# Altium project Invertor 2000W.PrjPcb
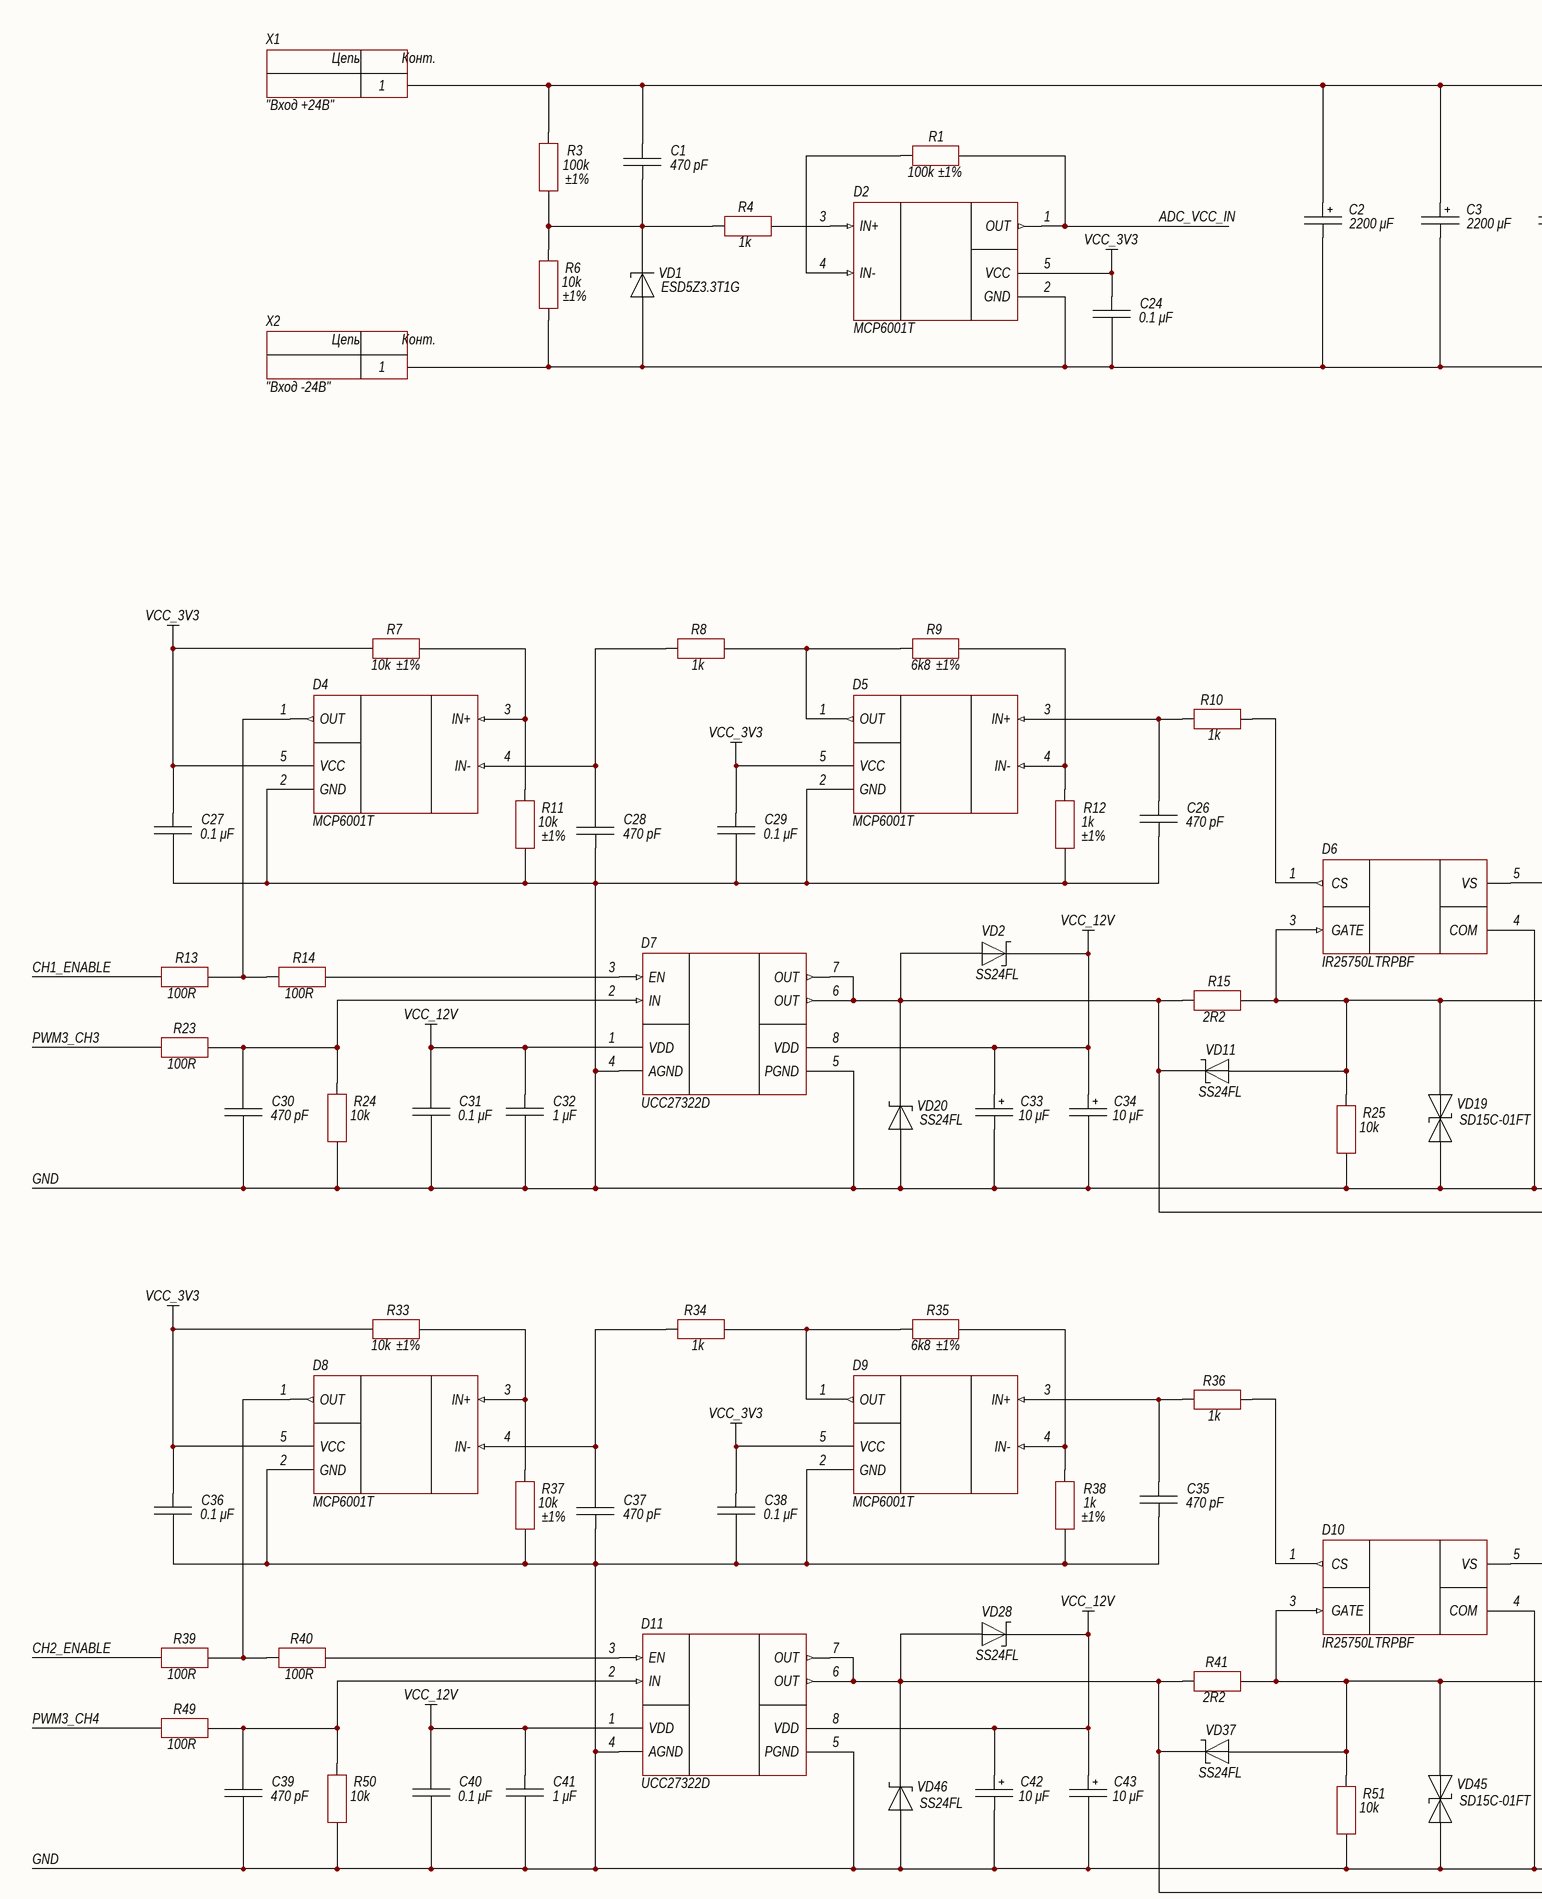
[diagram p0: Page 1.SchDoc, top left]
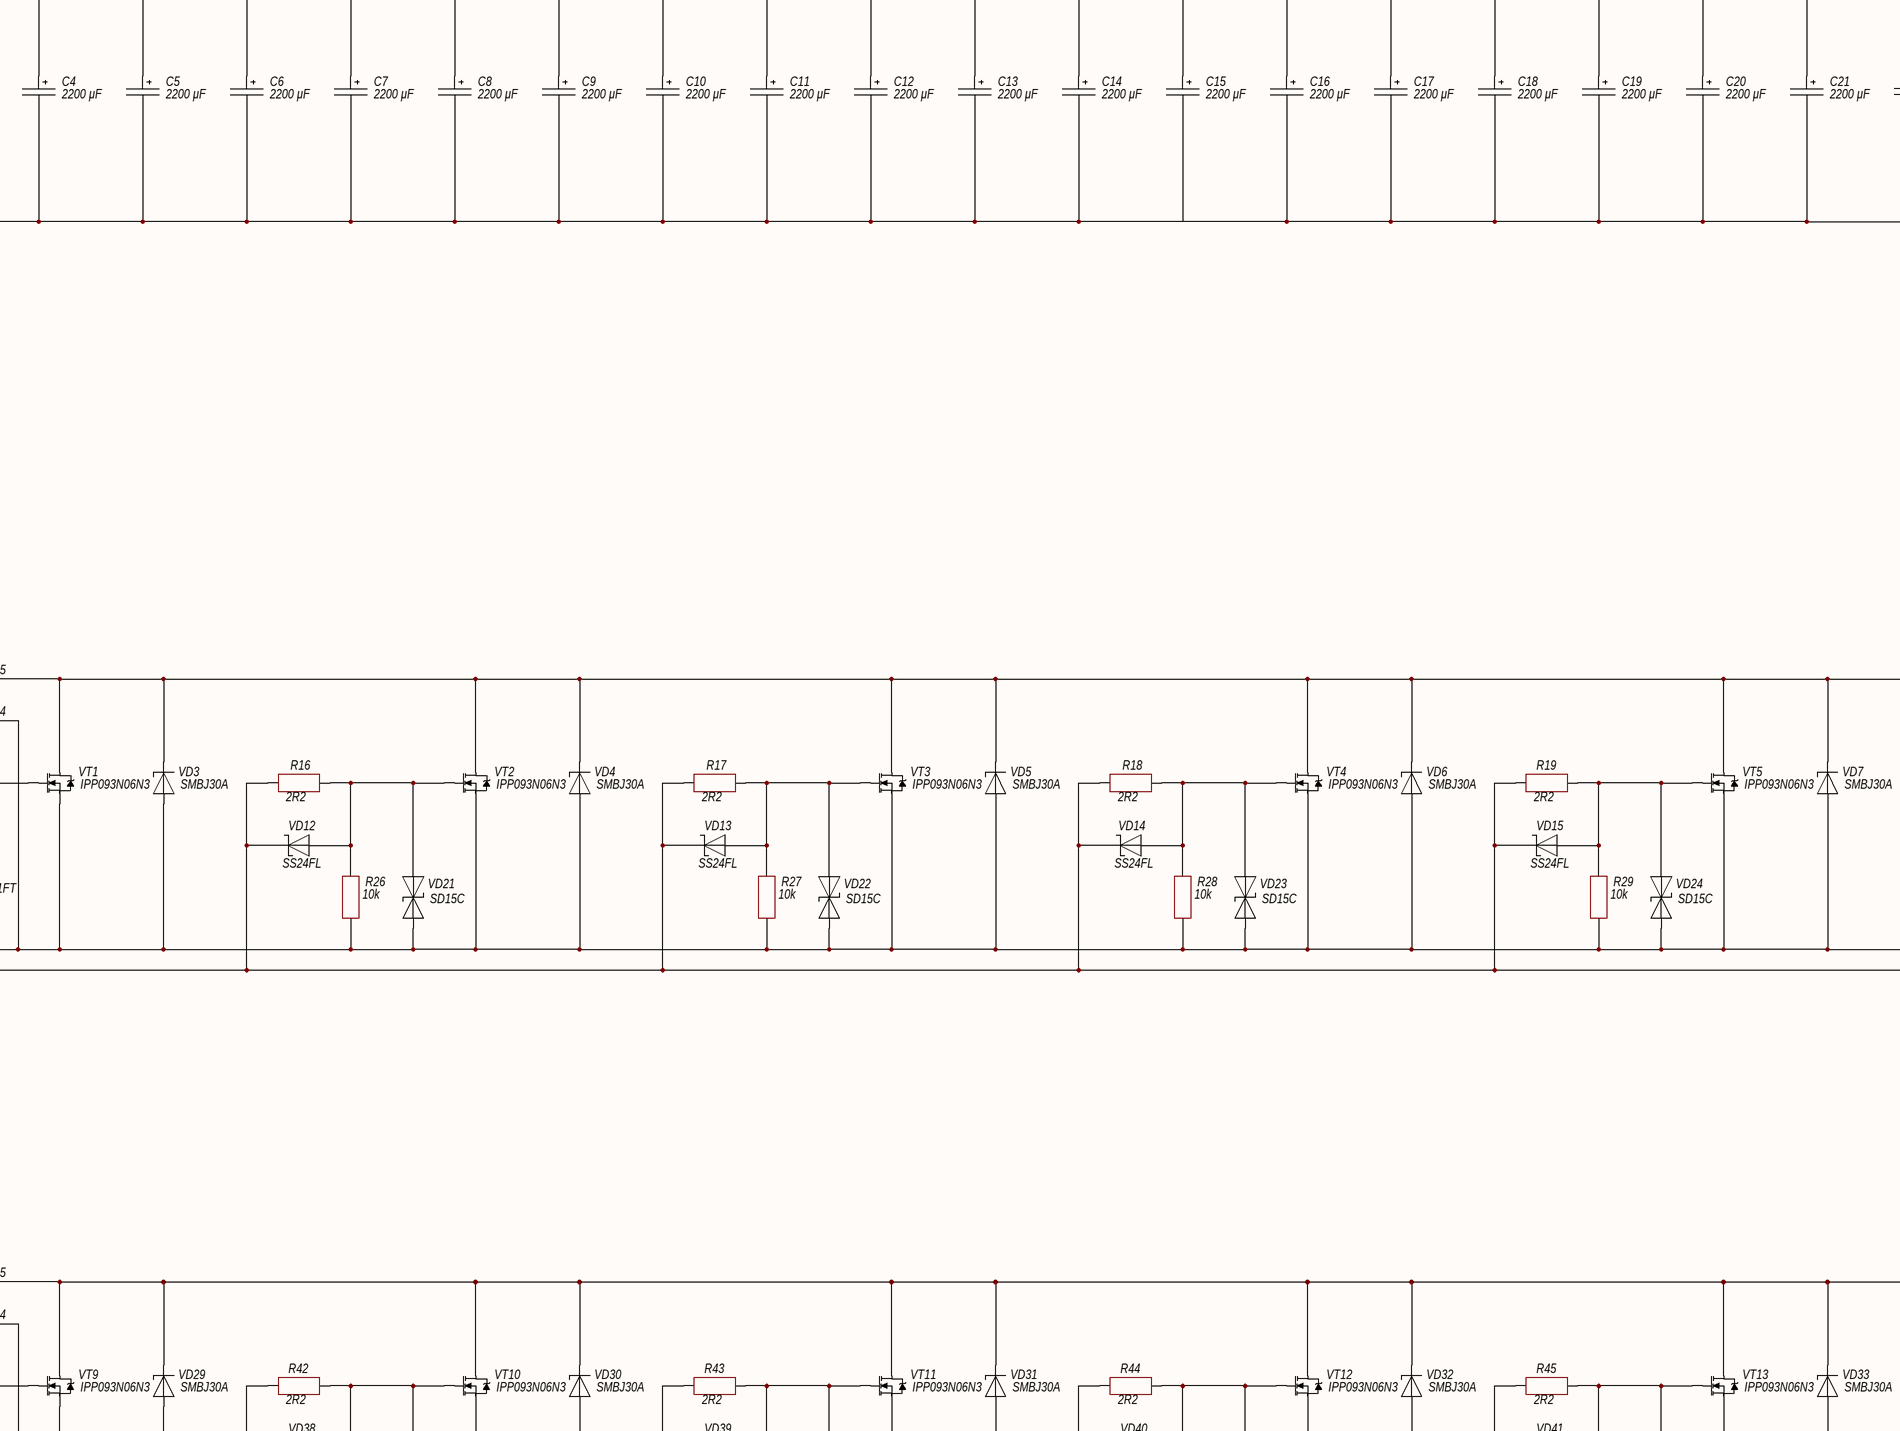
[diagram p1: Page 1.SchDoc, top middle]
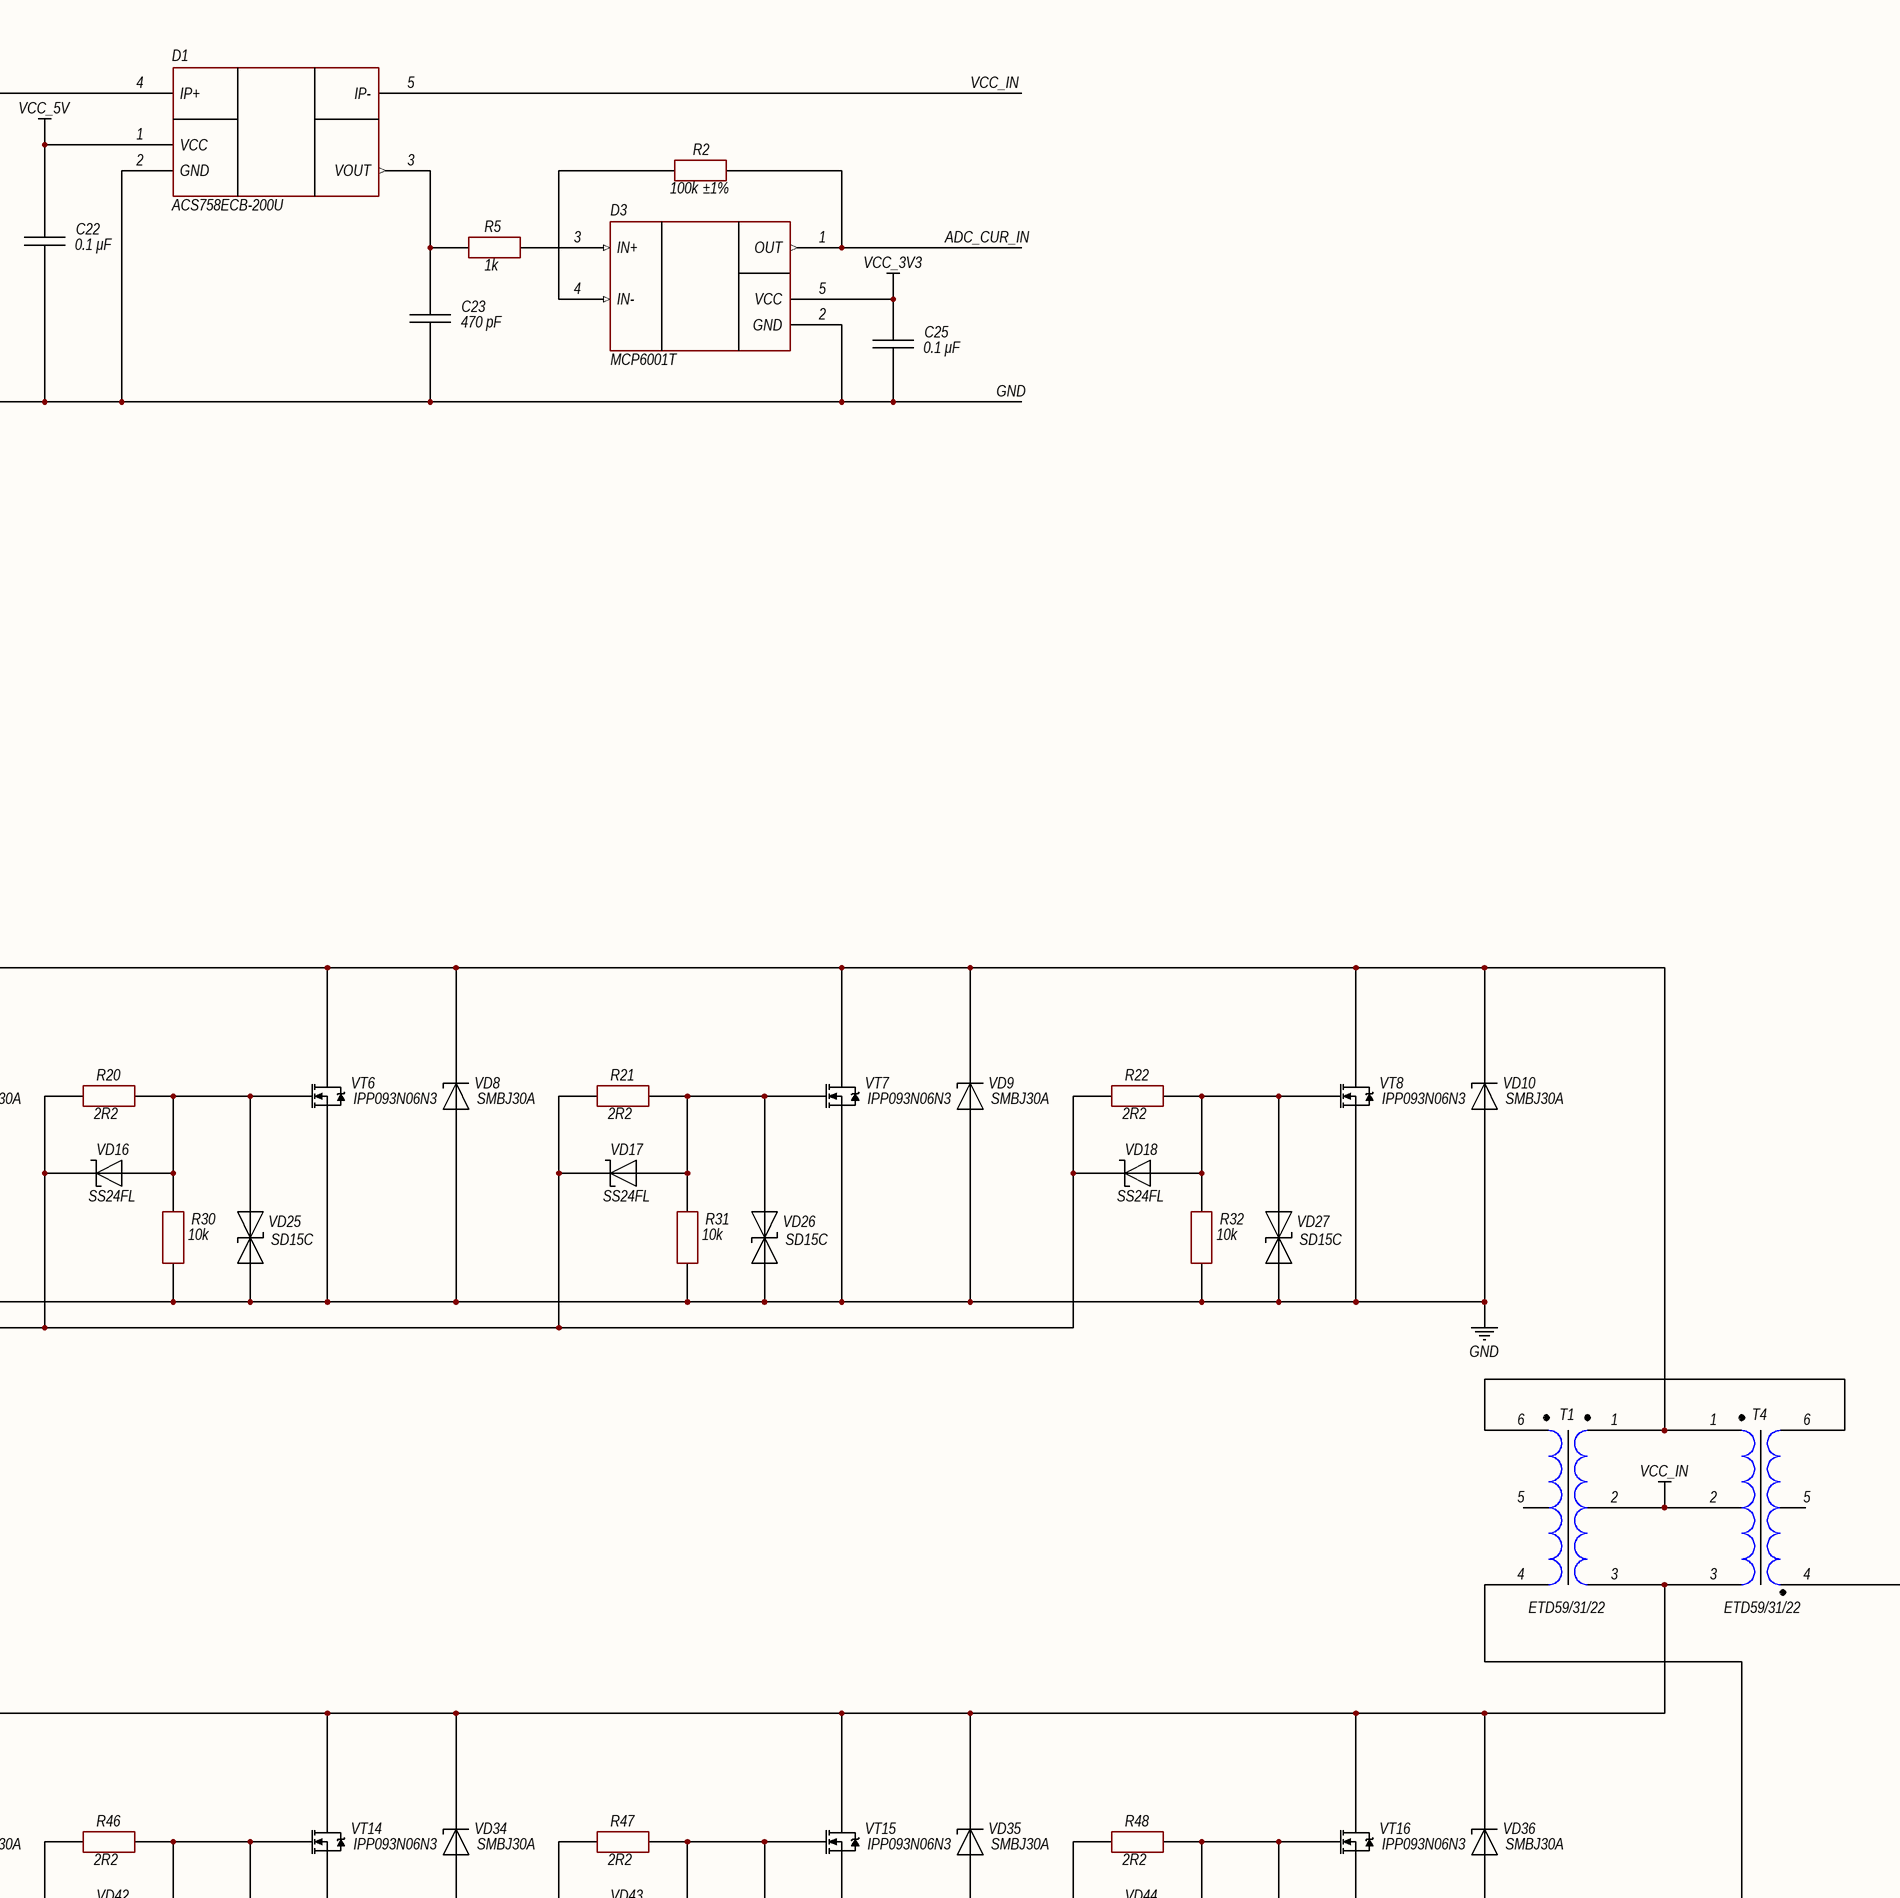
[diagram p2: Page 1.SchDoc, top right]
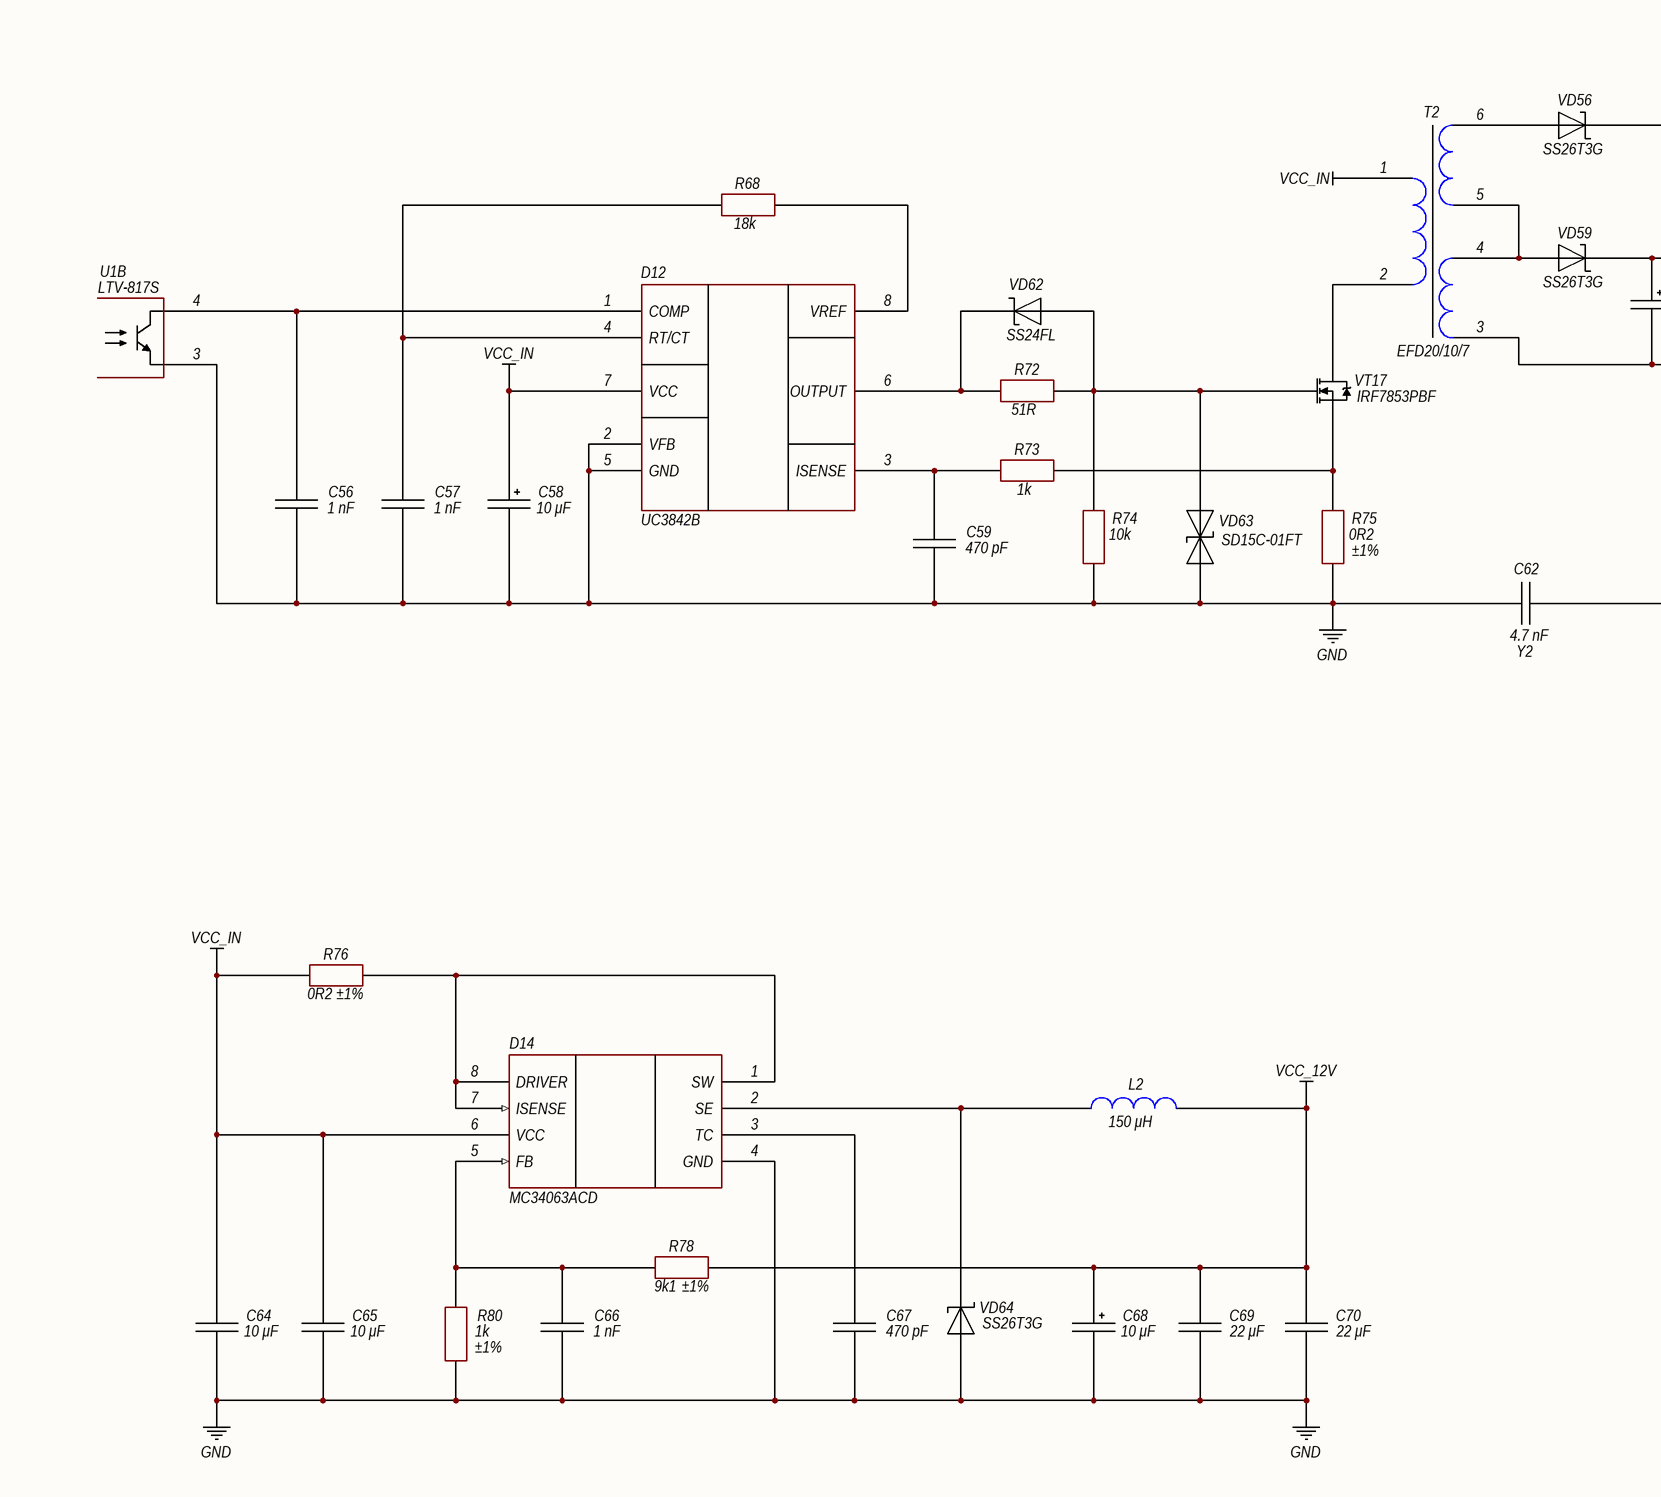
[diagram p3: Page 1.SchDoc, bottom left]
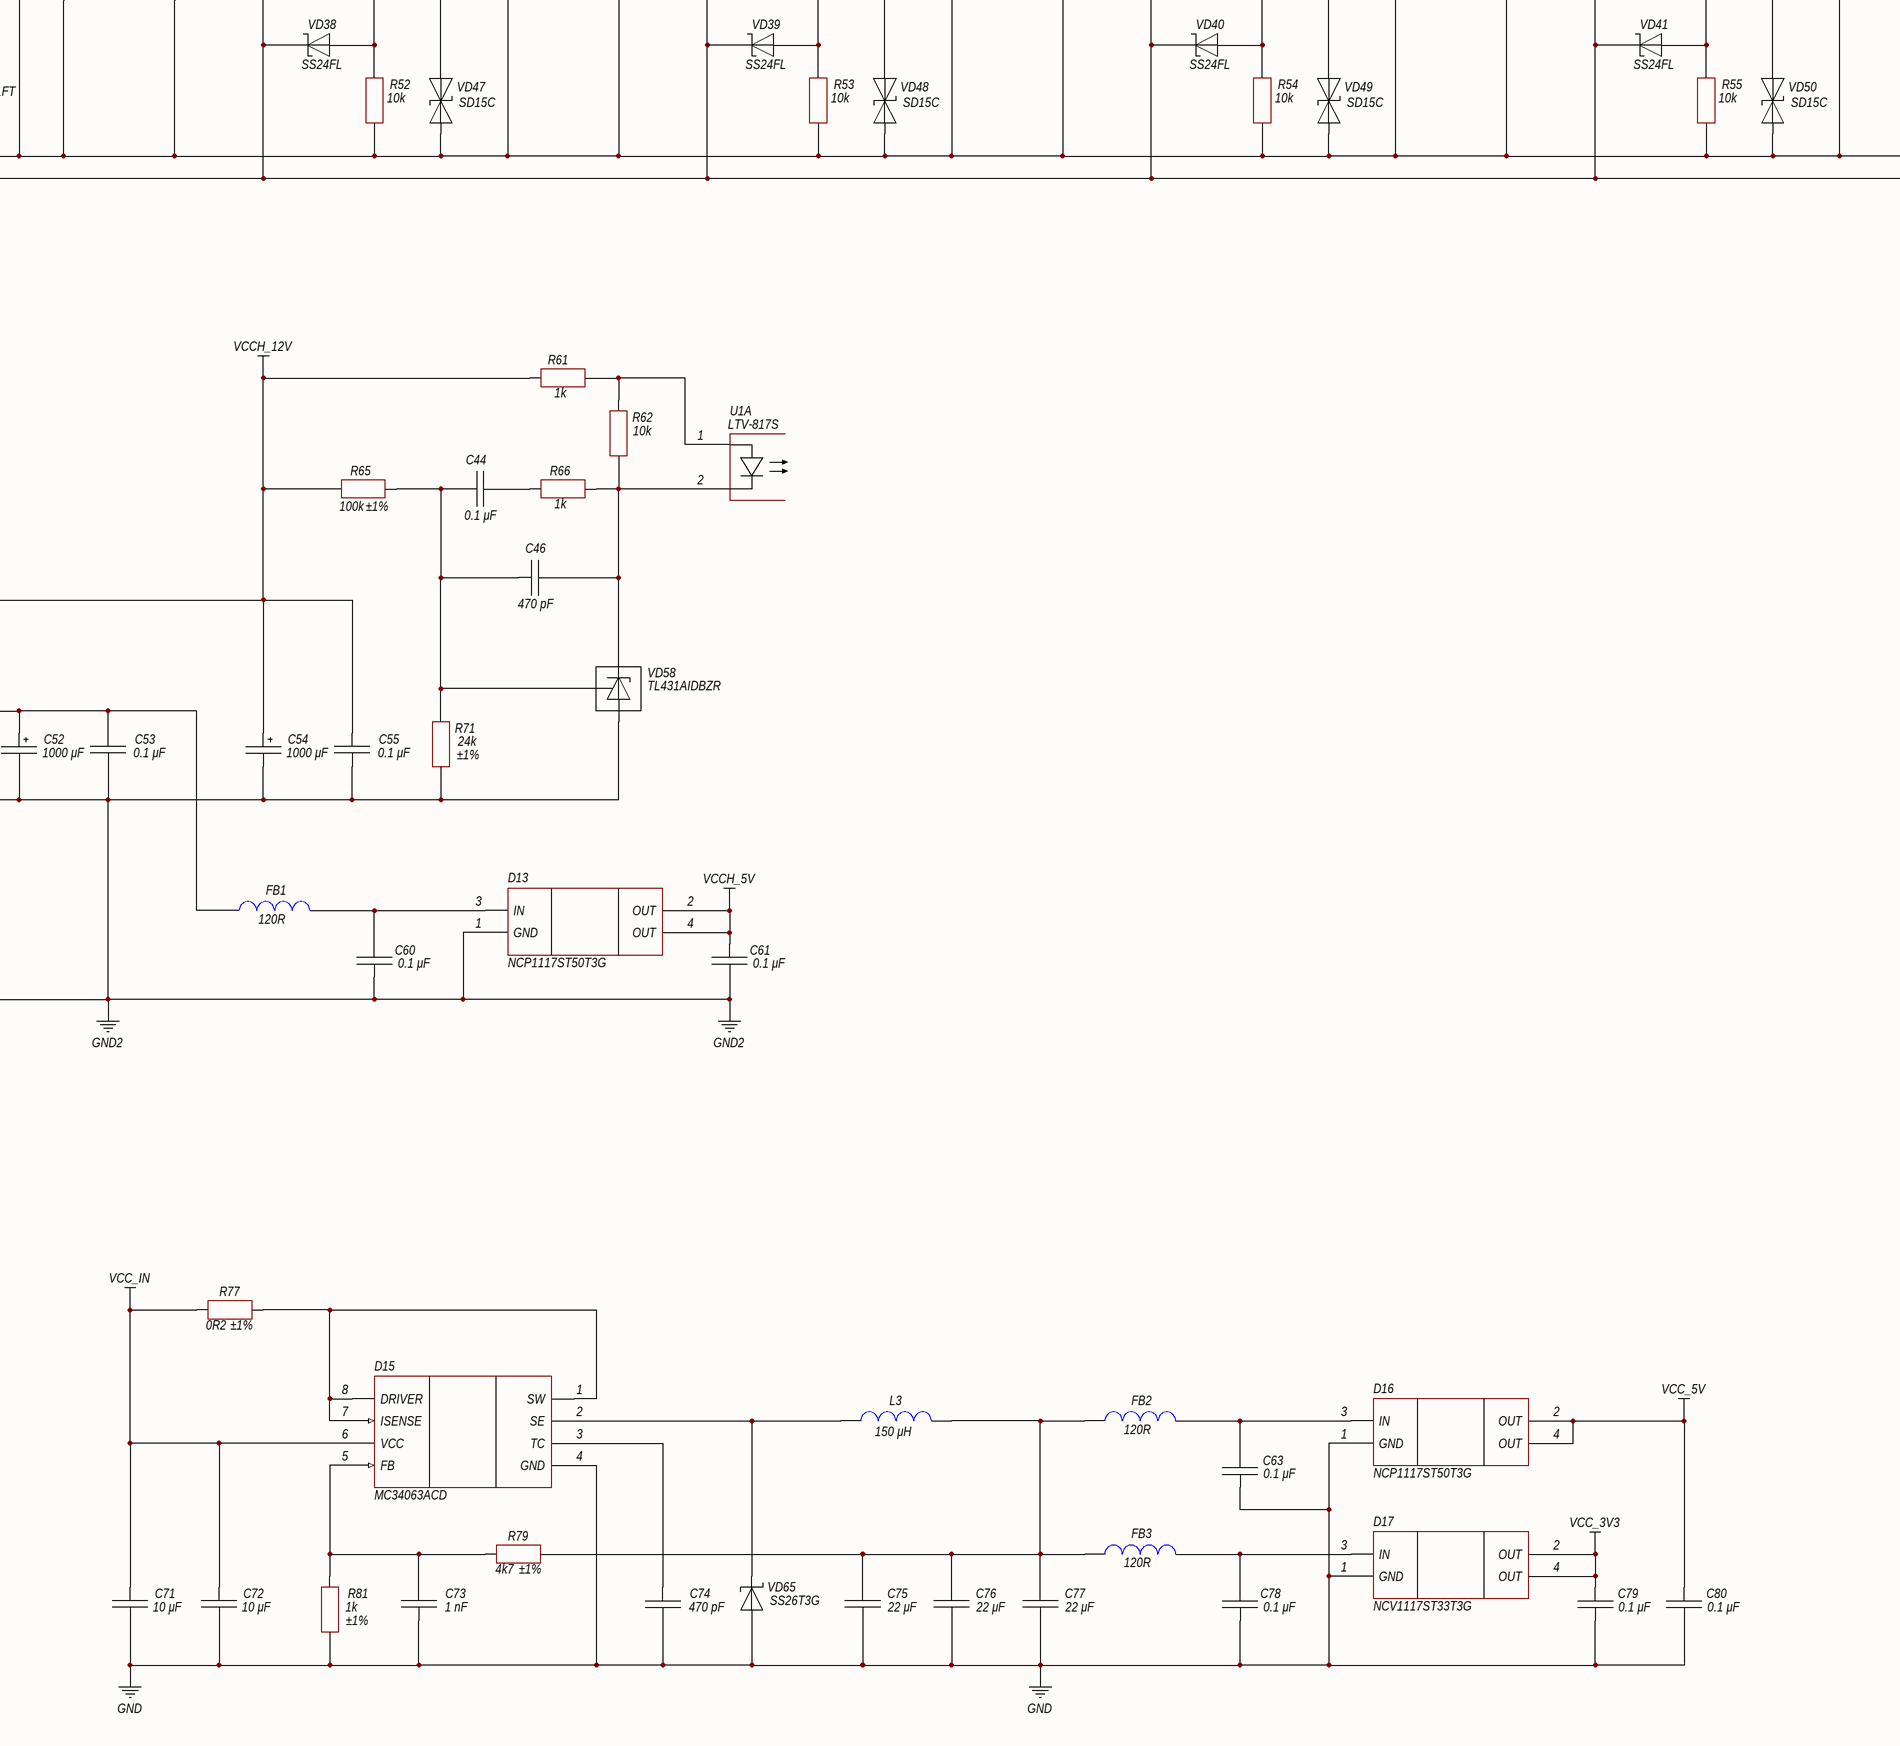
[diagram p4: Page 1.SchDoc, bottom middle]
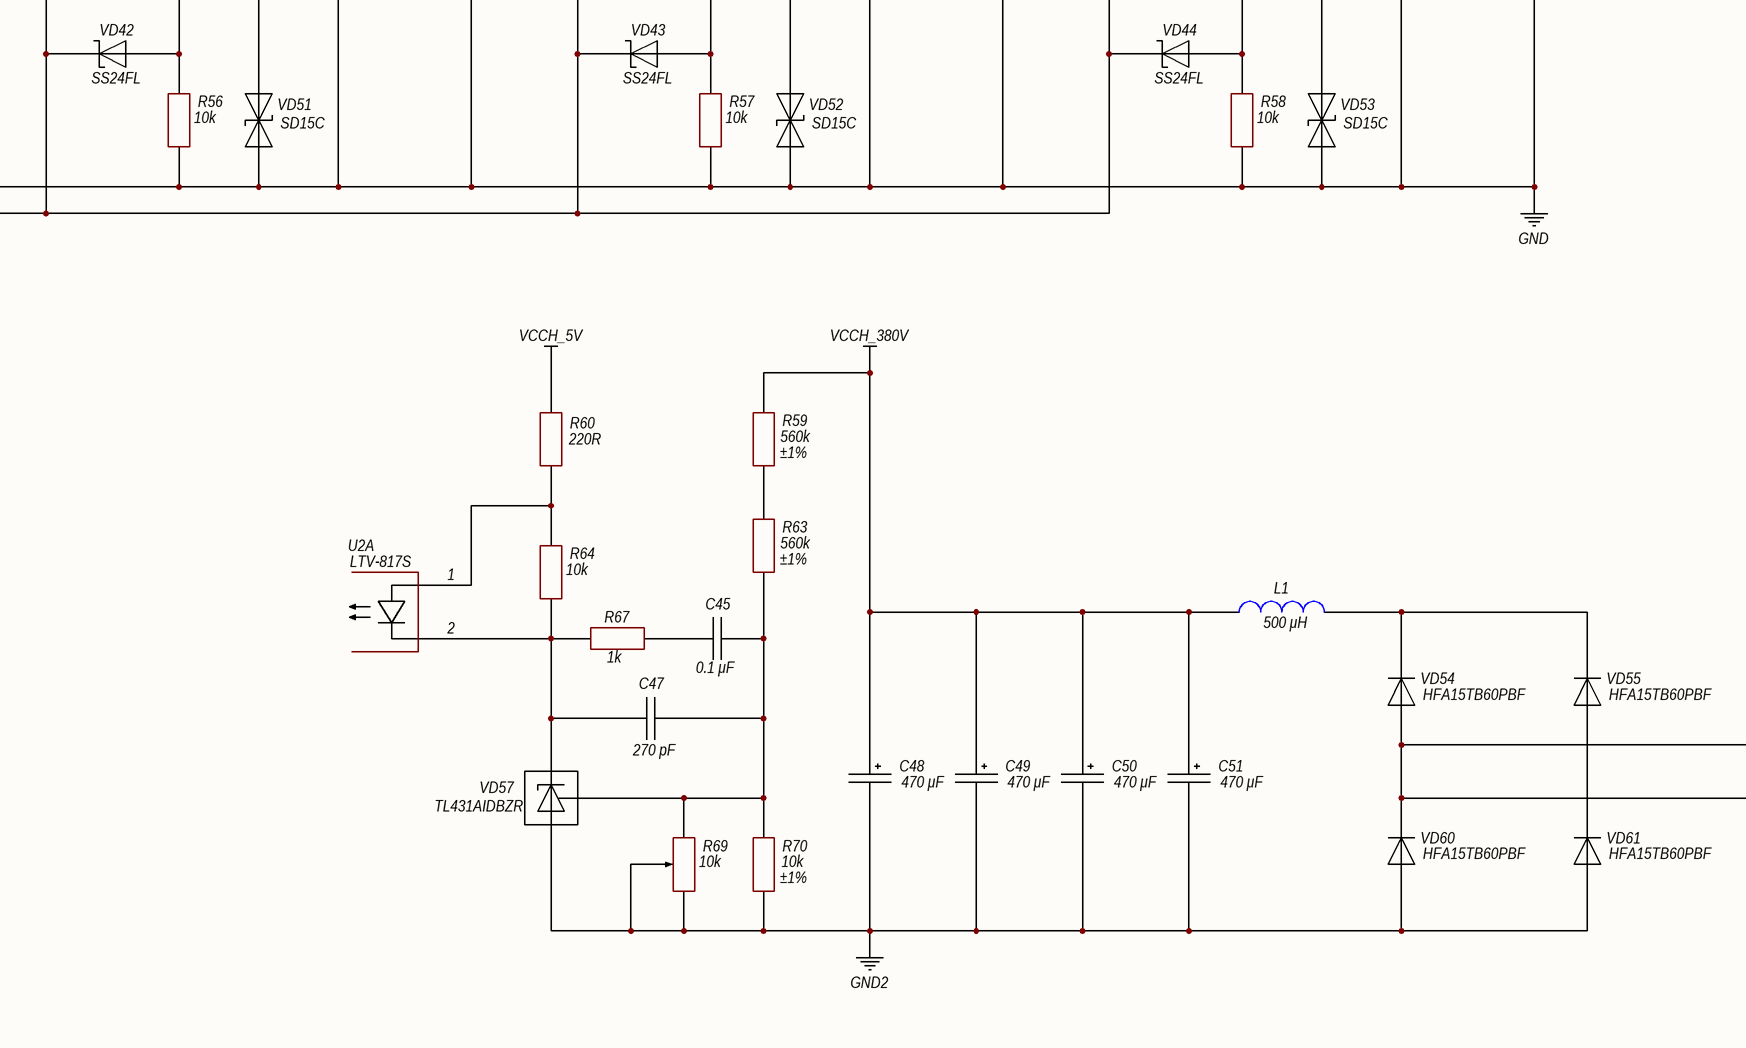
[diagram p5: Page 1.SchDoc, bottom right]
3 sheets, 447 parts. Net scope: global (net labels, ports and power ports of the same name join across sheets).
Board file: PCB for invertor.PcbDoc
Sheets:
  Page 1.SchDoc
  Page 2.SchDoc
  Page 3.SchDoc

## Sheet Page 1.SchDoc: Инвертор напряжения 24-380-230В
size 1188 x 840 mm; CompanyName: Nordic Energy; Address1: Address1; Address2: Address2; Address3: Address3; Address4: Address4; DocumentNumber: НЭС.185014.2017-5.1; SheetNumber: 1; SheetTotal: 3; Scale: 1:1; Title2str: номинальной мощностью 2000 Вт; DocumentType: Схема электрическая принципиальная; FirstReferrence: НЭС.185014.2017-5.1

### Parts
C1  470 pF  [CH0805C]
C2  2200 μF  [D16C7.5H25]
C3  2200 μF  [D16C7.5H25]
C4  2200 μF  [D16C7.5H25]
C5  2200 μF  [D16C7.5H25]
C6  2200 μF  [D16C7.5H25]
C7  2200 μF  [D16C7.5H25]
C8  2200 μF  [D16C7.5H25]
C9  2200 μF  [D16C7.5H25]
C10  2200 μF  [D16C7.5H25]
C11  2200 μF  [D16C7.5H25]
C12  2200 μF  [D16C7.5H25]
C13  2200 μF  [D16C7.5H25]
C14  2200 μF  [D16C7.5H25]
C15  2200 μF  [D16C7.5H25]
C16  2200 μF  [D16C7.5H25]
C17  2200 μF  [D16C7.5H25]
C18  2200 μF  [D16C7.5H25]
C19  2200 μF  [D16C7.5H25]
C20  2200 μF  [D16C7.5H25]
C21  2200 μF  [D16C7.5H25]
C22  0.1 μF  [CH0805C]
C23  470 pF  [CH0805C]
C24  0.1 μF  [CH0805C]
C25  0.1 μF  [CH0805C]
C26  470 pF  [CH0805C]
C27  0.1 μF  [CH0805C]
C28  470 pF  [CH0805C]
C29  0.1 μF  [CH0805C]
C30  470 pF  [CH0805C]
C31  0.1 μF  [CH0805C]
C32  1 μF  [CH0805C]
C33  10 μF  [TANTAL_C]
C34  10 μF  [TANTAL_C]
C35  470 pF  [CH0805C]
C36  0.1 μF  [CH0805C]
C37  470 pF  [CH0805C]
C38  0.1 μF  [CH0805C]
C39  470 pF  [CH0805C]
C40  0.1 μF  [CH0805C]
C41  1 μF  [CH0805C]
C42  10 μF  [TANTAL_C]
C43  10 μF  [TANTAL_C]
C44  0.1 μF  [CH0805C]
C45  0.1 μF  [CH0805C]
C46  470 pF  [CH0805C]
C47  270 pF  [CH0805C]
C48  470 μF  [D35C10.5H50]
C49  470 μF  [D35C10.5H50]
C50  470 μF  [D35C10.5H50]
C51  470 μF  [D35C10.5H50]
C52  1000 μF  [D10C5H20]
C53  0.1 μF  [CH0805C]
C54  1000 μF  [D10C5H20]
C55  0.1 μF  [CH0805C]
C56  1 nF  [CH0805C]
C57  1 nF  [CH0805C]
C58  10 μF  [TANTAL_C]
C59  470 pF  [CH0805C]
C60  0.1 μF  [CH0805C]
C61  0.1 μF  [CH0805C]
C62  4.7 nF  ComponentKind: Y2  [CAP: B32021]
C63  0.1 μF  [CH0805C]
C64  10 μF  [CH1206C]
C65  10 μF  [CH1206C]
C66  1 nF  [CH0805C]
C67  470 pF  [CH0805C]
C68  10 μF  [TANTAL_C]
C69  22 μF  [CH1206C]
C70  22 μF  [CH1206C]
C71  10 μF  [CH1206C]
C72  10 μF  [CH1206C]
C73  1 nF  [CH0805C]
C74  470 pF  [CH0805C]
C75  22 μF  [CH1206C]
C76  22 μF  [CH1206C]
C77  22 μF  [CH1206C]
C78  0.1 μF  [CH0805C]
C79  0.1 μF  [CH0805C]
C80  0.1 μF  [CH0805C]
D1  ACS758ECB-200U  [IC: ACS770]
D2  MCP6001T  [SOT23-5]
D3  MCP6001T  [SOT23-5]
D4  MCP6001T  [SOT23-5]
D5  MCP6001T  [SOT23-5]
D6  IR25750LTRPBF  [SOT23-5]
D7  UCC27322D  [8-SOIC]
D8  MCP6001T  [SOT23-5]
D9  MCP6001T  [SOT23-5]
D10  IR25750LTRPBF  [SOT23-5]
D11  UCC27322D  [8-SOIC]
D12  UC3842B  [8-SOIC]
D13  NCP1117ST50T3G  [SOT223]
D14  MC34063ACD  [8-SOIC]
D15  MC34063ACD  [8-SOIC]
D16  NCP1117ST50T3G  [SOT223]
D17  NCV1117ST33T3G  [SOT223]
FB1  120R  [CH0805L]
FB2  120R  [CH0805L]
FB3  120R  [CH0805L]
L1  500 μH  [IND: R46]
L2  150 μH  [IND: B82477G4]
L3  150 μH  [IND: B82477G4]
R1  100k  ComponentKind: ±1%  [CH0805R]
R2  100k  ComponentKind: ±1%  [CH0805R]
R3  100k  ComponentKind: ±1%  [CH0805R]
R4  1k  [CH0805R]
R5  1k  [CH0805R]
R6  10k  ComponentKind: ±1%  [CH0805R]
R7  10k  ComponentKind: ±1%  [CH0805R]
R8  1k  [CH0805R]
R9  6k8  ComponentKind: ±1%  [CH0805R]
R10  1k  [CH0805R]
R11  10k  ComponentKind: ±1%  [CH0805R]
R12  1k  ComponentKind: ±1%  [CH0805R]
R13  100R  [CH0805R]
R14  100R  [CH0805R]
R15  2R2  [CH0805R]
R16  2R2  [CH0805R]
R17  2R2  [CH0805R]
R18  2R2  [CH0805R]
R19  2R2  [CH0805R]
R20  2R2  [CH0805R]
R21  2R2  [CH0805R]
R22  2R2  [CH0805R]
R23  100R  [CH0805R]
R24  10k  [CH0805R]
R25  10k  [CH0805R]
R26  10k  [CH0805R]
R27  10k  [CH0805R]
R28  10k  [CH0805R]
R29  10k  [CH0805R]
R30  10k  [CH0805R]
R31  10k  [CH0805R]
R32  10k  [CH0805R]
R33  10k  ComponentKind: ±1%  [CH0805R]
R34  1k  [CH0805R]
R35  6k8  ComponentKind: ±1%  [CH0805R]
R36  1k  [CH0805R]
R37  10k  ComponentKind: ±1%  [CH0805R]
R38  1k  ComponentKind: ±1%  [CH0805R]
R39  100R  [CH0805R]
R40  100R  [CH0805R]
R41  2R2  [CH0805R]
R42  2R2  [CH0805R]
R43  2R2  [CH0805R]
R44  2R2  [CH0805R]
R45  2R2  [CH0805R]
R46  2R2  [CH0805R]
R47  2R2  [CH0805R]
R48  2R2  [CH0805R]
R49  100R  [CH0805R]
R50  10k  [CH0805R]
R51  10k  [CH0805R]
R52  10k  [CH0805R]
R53  10k  [CH0805R]
R54  10k  [CH0805R]
R55  10k  [CH0805R]
R56  10k  [CH0805R]
R57  10k  [CH0805R]
R58  10k  [CH0805R]
R59  560k  ComponentKind: ±1%  [CH0805R]
R60  220R  [CH0805R]
R61  1k  [CH0805R]
R62  10k  [CH0805R]
R63  560k  ComponentKind: ±1%  [CH0805R]
R64  10k  [CH0805R]
R65  100k  ComponentKind: ±1%  [CH0805R]
R66  1k  [CH0805R]
R67  1k  [CH0805R]
R68  18k  [CH0805R]
R69  10k  [RES: 3296W]
R70  10k  ComponentKind: ±1%  [CH0805R]
R71  24k  ComponentKind: ±1%  [CH0805R]
R72  51R  [CH0805R]
R73  1k  [CH0805R]
R74  10k  [CH0805R]
R75  0R2  ComponentKind: ±1%  [CH1206R]
R76  0R2  ComponentKind: ±1%  [CH1206R]
R77  0R2  ComponentKind: ±1%  [CH1206R]
R78  9k1  ComponentKind: ±1%  [CH0805R]
R79  4k7  ComponentKind: ±1%  [CH0805R]
R80  1k  ComponentKind: ±1%  [CH0805R]
R81  1k  ComponentKind: ±1%  [CH0805R]
T1  ETD59/31/22  [TRANS: ETD59/31/22]
T2  EFD20/10/7  [TRANS: EFD20/10/7]
T4  ETD59/31/22  [TRANS: ETD59/31/22]
U1  LTV-817S  [4-SMD]  (parts A,B of 2)
U2  LTV-817S  [4-SMD]  (part A of 2)
VD1  ESD5Z3.3T1G  [SOD523]
VD2  SS24FL  [SOD123F]
VD3  SMBJ30A  [SMB]
VD4  SMBJ30A  [SMB]
VD5  SMBJ30A  [SMB]
VD6  SMBJ30A  [SMB]
VD7  SMBJ30A  [SMB]
VD8  SMBJ30A  [SMB]
VD9  SMBJ30A  [SMB]
VD10  SMBJ30A  [SMB]
VD11  SS24FL  [SOD123F]
VD12  SS24FL  [SOD123F]
VD13  SS24FL  [SOD123F]
VD14  SS24FL  [SOD123F]
VD15  SS24FL  [SOD123F]
VD16  SS24FL  [SOD123F]
VD17  SS24FL  [SOD123F]
VD18  SS24FL  [SOD123F]
VD19  SD15C-01FT  [SOD323]
VD20  SS24FL  [SOD123F]
VD21  SD15C  [SOD323]
VD22  SD15C  [SOD323]
VD23  SD15C  [SOD323]
VD24  SD15C  [SOD323]
VD25  SD15C  [SOD323]
VD26  SD15C  [SOD323]
VD27  SD15C  [SOD323]
VD28  SS24FL  [SOD123F]
VD29  SMBJ30A  [SMB]
VD30  SMBJ30A  [SMB]
VD31  SMBJ30A  [SMB]
VD32  SMBJ30A  [SMB]
VD33  SMBJ30A  [SMB]
VD34  SMBJ30A  [SMB]
VD35  SMBJ30A  [SMB]
VD36  SMBJ30A  [SMB]
VD37  SS24FL  [SOD123F]
VD38  SS24FL  [SOD123F]
VD39  SS24FL  [SOD123F]
VD40  SS24FL  [SOD123F]
VD41  SS24FL  [SOD123F]
VD42  SS24FL  [SOD123F]
VD43  SS24FL  [SOD123F]
VD44  SS24FL  [SOD123F]
VD45  SD15C-01FT  [SOD323]
VD46  SS24FL  [SOD123F]
VD47  SD15C  [SOD323]
VD48  SD15C  [SOD323]
VD49  SD15C  [SOD323]
VD50  SD15C  [SOD323]
VD51  SD15C  [SOD323]
VD52  SD15C  [SOD323]
VD53  SD15C  [SOD323]
VD54  HFA15TB60PBF  [TO220-2]
VD55  HFA15TB60PBF  [TO220-2]
VD56  SS26T3G  [SMB]
VD57  TL431AIDBZR  [SOT23_132]
VD58  TL431AIDBZR  [SOT23_132]
VD59  SS26T3G  [SMB]
VD60  HFA15TB60PBF  [TO220-2]
VD61  HFA15TB60PBF  [TO220-2]
VD62  SS24FL  [SOD123F]
VD63  SD15C-01FT  [SOD323]
VD64  SS26T3G  [SMB]
VD65  SS26T3G  [SMB]
VT1  IPP093N06N3  [TO220_123]
VT2  IPP093N06N3  [TO220_123]
VT3  IPP093N06N3  [TO220_123]
VT4  IPP093N06N3  [TO220_123]
VT5  IPP093N06N3  [TO220_123]
VT6  IPP093N06N3  [TO220_123]
VT7  IPP093N06N3  [TO220_123]
VT8  IPP093N06N3  [TO220_123]
VT9  IPP093N06N3  [TO220_123]
VT10  IPP093N06N3  [TO220_123]
VT11  IPP093N06N3  [TO220_123]
VT12  IPP093N06N3  [TO220_123]
VT13  IPP093N06N3  [TO220_123]
VT14  IPP093N06N3  [TO220_123]
VT15  IPP093N06N3  [TO220_123]
VT16  IPP093N06N3  [TO220_123]
VT17  IRF7853PBF  [TRANS: SO-8]
X1  "Вход +24В"  [CON: 7461383]
X2  "Вход -24В"  [CON: 7461383]

### Nets
GND: C2.2 C3.2 C4.2 C5.2 C6.2 C7.2 C8.2 C9.2 C10.2 C11.2 C12.2 C13.2 C14.2 C15.2 C16.2 C17.2 C18.2 C19.2 C20.2 C21.2 C22.1 C23.2 C24.1 C25.1 C26.2 C27.1 C28.2 C29.1 C30.2 C31.1 C32.1 C33.2 C34.2 C35.2 C36.1 C37.2 C38.1 C39.2 C40.1 C41.1 C42.2 C43.2 C56.1 C57.1 C58.2 C59.2 C62.1 C63.1 C64.1 C65.1 C66.1 C67.2 C68.2 C69.1 C70.1 C71.1 C72.1 C73.1 C74.2 C75.1 C76.1 C77.1 C78.1 C79.1 C80.1 D1.2(GND) D2.2(GND) D3.2(GND) D4.2(GND) D5.2(GND) D6.4(COM) D7.4(AGND) D7.5(PGND) D8.2(GND) D9.2(GND) D10.4(COM) D11.4(AGND) D11.5(PGND) D12.2(VFB) D12.5(GND) D14.4(GND) D15.4(GND) D16.1(GND) D17.1(GND) R6.2 R11.2 R12.2 R24.1 R25.1 R26.1 R27.1 R28.1 R29.1 R30.1 R31.1 R32.1 R37.2 R38.2 R50.1 R51.1 R52.1 R53.1 R54.1 R55.1 R56.1 R57.1 R58.1 R74.1 R75.2 R80.2 R81.2 U1.3(E) VD1.1(A) VD3.1(A) VD4.1(A) VD5.1(A) VD6.1(A) VD7.1(A) VD8.1(A) VD9.1(A) VD10.1(A) VD19.1(A) VD20.1 VD21.1(A) VD22.1(A) VD23.1(A) VD24.1(A) VD25.1(A) VD26.1(A) VD27.1(A) VD29.1(A) VD30.1(A) VD31.1(A) VD32.1(A) VD33.1(A) VD34.1(A) VD35.1(A) VD36.1(A) VD45.1(A) VD46.1 VD47.1(A) VD48.1(A) VD49.1(A) VD50.1(A) VD51.1(A) VD52.1(A) VD53.1(A) VD63.1(A) VD64.1 VD65.1 VT1.3(S) VT2.3(S) VT3.3(S) VT4.3(S) VT5.3(S) VT6.3(S) VT7.3(S) VT8.3(S) VT9.3(S) VT10.3(S) VT11.3(S) VT12.3(S) VT13.3(S) VT14.3(S) VT15.3(S) VT16.3(S) X2.1
GND2: C48.2 C49.2 C50.2 C51.2 C52.2 C53.1 C54.2 C55.1 C60.1 C61.1 C62.2 D13.1(GND) R69.1 R69.2 R70.2 R71.2 T2.3 VD57.3 VD58.3 VD60.1 VD61.1
VCC_3V3: C24.2 C25.2 C27.2 C29.2 C36.2 C38.2 C79.2 D2.5(VCC) D3.5(VCC) D4.5(VCC) D5.5(VCC) D8.5(VCC) D9.5(VCC) D17.2(OUT) D17.4(OUT) R7.2 R33.2
VCC_5V: C22.2 C80.2 D1.1(VCC) D16.2(OUT) D16.4(OUT)
VCC_12V: C31.2 C32.2 C33.1 C34.1 C40.2 C41.2 C42.1 C43.1 C68.1 C69.2 C70.2 D7.1(VDD) D7.8(VDD) D11.1(VDD) D11.8(VDD) L2.1 R78.2 VD2.2 VD28.2
VCC_IN: C58.1 C64.2 C65.2 C71.2 C72.2 D1.5(IP-) D12.7(VCC) D14.6(VCC) D15.6(VCC) R76.2 R77.2 T1.2 T2.1 T4.2
VCCH_5V: C61.2 D13.2(OUT) D13.4(OUT) R60.2
VCCH_12V: C54.1 C55.2 R61.2 R65.1 VD56.2
VCCH_380V: C48.1 C49.1 C50.1 C51.1 L1.2 R59.1
ADC_CUR_IN: D3.1(OUT) R2.2
ADC_VCC_IN: D2.1(OUT) R1.2
CH1_ENABLE: R13.2
CH2_ENABLE: R39.2
PWM3_CH3: R23.2
PWM3_CH4: R49.2
NetC1_1: C1.1 C2.1 C3.1 C4.1 C5.1 C6.1 C7.1 C8.1 C9.1 C10.1 C11.1 C12.1 C13.1 C14.1 C15.1 C16.1 C17.1 C18.1 C19.1 C20.1 C21.1 D1.4(IP+) R3.1 X1.1
NetC1_2: C1.2 R3.2 R4.2 R6.1 VD1.2(C)
NetC23_1: C23.1 D1.3(VOUT) R5.2
NetC26_1: C26.1 D5.3(IN+) R10.2
NetC28_1: C28.1 D4.4(IN-) R8.2
NetC30_1: C30.1 D7.2(IN) R23.1 R24.2
NetC35_1: C35.1 D9.3(IN+) R36.2
NetC37_1: C37.1 D8.4(IN-) R34.2
NetC39_1: C39.1 D11.2(IN) R49.1 R50.2
NetC44_1: C44.1 C46.1 R65.2 R71.1 VD58.2
NetC44_2: C44.2 R66.2
NetC45_1: C45.1 C47.1 R63.2 R69.3 R70.1 VD57.2
NetC45_2: C45.2 R67.2
NetC46_2: C46.2 R62.1 R66.1 U1.2(C) VD58.1
NetC47_2: C47.2 R64.1 R67.1 U2.2(C) VD57.1
NetC52_1: C52.1 C53.2 FB1.2 VD59.2
NetC56_2: C56.2 D12.1(COMP) U1.4(C)
NetC57_2: C57.2 D12.4(RT/CT) R68.2
NetC59_1: C59.1 D12.3(ISENSE) R73.1
NetC60_2: C60.2 D13.3(IN) FB1.1
NetC63_2: C63.2 D16.3(IN) FB2.1
NetC66_2: C66.2 D14.5(FB) R78.1 R80.1
NetC67_1: C67.1 D14.3(TC)
NetC73_2: C73.2 D15.5(FB) R79.1 R81.1
NetC74_1: C74.1 D15.3(TC)
NetC75_2: C75.2 C76.2 C77.2 FB2.2 FB3.2 L3.1 R79.2
NetC78_2: C78.2 D17.3(IN) FB3.1
NetD2_3: D2.3(IN+) R4.1
NetD2_4: D2.4(IN-) R1.1
NetD3_3: D3.3(IN+) R5.1
NetD3_4: D3.4(IN-) R2.1
NetD4_1: D4.1(OUT) R13.1 R14.2
NetD4_3: D4.3(IN+) R7.1 R11.1
NetD5_1: D5.1(OUT) R8.1 R9.2
NetD5_4: D5.4(IN-) R9.1 R12.1
NetD6_1: D6.1(CS) R10.1
NetD6_3: D6.3(GATE) R15.1 R25.2 VD11.1 VD19.2(C) VT1.1(G)
NetD6_5: D6.5(VS) T1.1 T4.1 VD3.2(C) VD4.2(C) VD5.2(C) VD6.2(C) VD7.2(C) VD8.2(C) VD9.2(C) VD10.2(C) VT1.2(D) VT2.2(D) VT3.2(D) VT4.2(D) VT5.2(D) VT6.2(D) VT7.2(D) VT8.2(D)
NetD7_3: D7.3(EN) R14.1
NetD7_6: D7.6(OUT) D7.7(OUT) R15.2 R16.2 R17.2 R18.2 R19.2 R20.2 R21.2 R22.2 VD2.1 VD11.2 VD12.2 VD13.2 VD14.2 VD15.2 VD16.2 VD17.2 VD18.2 VD20.2
NetD8_1: D8.1(OUT) R39.1 R40.2
NetD8_3: D8.3(IN+) R33.1 R37.1
NetD9_1: D9.1(OUT) R34.1 R35.2
NetD9_4: D9.4(IN-) R35.1 R38.1
NetD10_1: D10.1(CS) R36.1
NetD10_3: D10.3(GATE) R41.1 R51.2 VD37.1 VD45.2(C) VT9.1(G)
NetD10_5: D10.5(VS) T1.3 T4.3 VD29.2(C) VD30.2(C) VD31.2(C) VD32.2(C) VD33.2(C) VD34.2(C) VD35.2(C) VD36.2(C) VT9.2(D) VT10.2(D) VT11.2(D) VT12.2(D) VT13.2(D) VT14.2(D) VT15.2(D) VT16.2(D)
NetD11_3: D11.3(EN) R40.1
NetD11_6: D11.6(OUT) D11.7(OUT) R41.2 R42.2 R43.2 R44.2 R45.2 R46.2 R47.2 R48.2 VD28.1 VD37.2 VD38.2 VD39.2 VD40.2 VD41.2 VD42.2 VD43.2 VD44.2 VD46.2
NetD12_6: D12.6(OUTPUT) R72.2 VD62.2
NetD12_8: D12.8(VREF) R68.1
NetD14_1: D14.1(SW) D14.7(ISENSE) D14.8(DRIVER) R76.1
NetD14_2: D14.2(SE) L2.2 VD64.2
NetD15_1: D15.1(SW) D15.7(ISENSE) D15.8(DRIVER) R77.1
NetD15_2: D15.2(SE) L3.2 VD65.2
NetL1_1: L1.1 VD54.2 VD55.2
NetR16_1: R16.1 R26.2 VD12.1 VD21.2(C) VT2.1(G)
NetR17_1: R17.1 R27.2 VD13.1 VD22.2(C) VT3.1(G)
NetR18_1: R18.1 R28.2 VD14.1 VD23.2(C) VT4.1(G)
NetR19_1: R19.1 R29.2 VD15.1 VD24.2(C) VT5.1(G)
NetR20_1: R20.1 R30.2 VD16.1 VD25.2(C) VT6.1(G)
NetR21_1: R21.1 R31.2 VD17.1 VD26.2(C) VT7.1(G)
NetR22_1: R22.1 R32.2 VD18.1 VD27.2(C) VT8.1(G)
NetR42_1: R42.1 R52.2 VD38.1 VD47.2(C) VT10.1(G)
NetR43_1: R43.1 R53.2 VD39.1 VD48.2(C) VT11.1(G)
NetR44_1: R44.1 R54.2 VD40.1 VD49.2(C) VT12.1(G)
NetR45_1: R45.1 R55.2 VD41.1 VD50.2(C) VT13.1(G)
NetR46_1: R46.1 R56.2 VD42.1 VD51.2(C) VT14.1(G)
NetR47_1: R47.1 R57.2 VD43.1 VD52.2(C) VT15.1(G)
NetR48_1: R48.1 R58.2 VD44.1 VD53.2(C) VT16.1(G)
NetR59_2: R59.2 R63.1
NetR60_1: R60.1 R64.2 U2.1(A)
NetR61_1: R61.1 R62.2 U1.1(A)
NetR72_1: R72.1 R74.2 VD62.1 VD63.2(C) VT17.1(G)
NetR73_2: R73.2 R75.1 VT17.3(S)
NetT1_4: T1.4 T4.4 VD54.1 VD60.2
NetT1_6: T1.6 T4.6
NetT2_2: T2.2 VT17.2(D)
NetT2_4: T2.4 T2.5 VD59.1
NetT2_6: T2.6 VD56.1
NetVD55_1: VD55.1 VD61.2

Not connected (* = marked no-connect by the designer): T1 5; T4 5

### Notes on the sheet
- Перв. примен.
- Справ. №
- Подп. и дата
- Инв. № дубл.
- Взам. инв. №
- Разраб.
- Изм.
- Лист
- № докум.
- Подп.
- Дата
- Лит.
- Масса
- Масштаб
- Пров.
- Т.контр.
- Листов
- Инв. № подл.
- Утв.
- Н.контр.
- 2.106-A1
- Копировал
- Формат А0
- (in symbol 1-Connector) Цепь; Конт.

### Library data of the parts
C1 C23 C26 C28 C30 C35 C37 C39 C46 C59 C67 C74 = Capacitor: Manufacturer: Yageo; Model: CC0805KRX7R9BB471; HelpURL: https://www.digikey.com/product-detail/en/yageo/CC0805KRX7R9BB471/311-1124-1-ND/303034; ComponentKind: X7R; Value: 470 pF
C2-C21 = AlumCap: Manufacturer: Epcos; Model: B41851F7228M000; HelpURL: https://www.digikey.com/products/en?keywords=B41851F7228M000; ComponentKind: 35V; Value: 2200 μF
C22 C24 C25 C27 C29 C31 C36 C38 C40 C44 C45 C53 C55 C60 C61 C63 C78-C80 = Capacitor: Manufacturer: Yageo; Model: CC0805KRX7R8BB104; HelpURL: https://www.digikey.com/product-detail/en/yageo/CC0805KRX7R8BB104/311-1141-1-ND/303051; ComponentKind: X7R; Value: 0.1 μF
C32 C41 = Capacitor: Manufacturer: Yageo; Model: CC0805KKX7R8BB105; HelpURL: https://www.digikey.com/product-detail/en/yageo/CC0805KKX7R8BB105/311-1456-1-ND/2833762; ComponentKind: X7R; Value: 1 μF
C33 C34 C42 C43 C58 C68 = TantalCap: Manufacturer: Vishay Sprague; Model: TR3C106K025C0300; HelpURL: https://www.digikey.com/product-detail/en/vishay-sprague/TR3C106K025C0300/718-1508-1-ND/1859983; ComponentKind: 25V; Value: 10 μF
C47 = Capacitor: Manufacturer: Yageo; Model: CC0805KRX7R9BB271; HelpURL: https://www.digikey.com/product-detail/en/yageo/CC0805KRX7R9BB271/311-1191-1-ND/372904; ComponentKind: X7R; Value: 270 pF
C48-C51 = AlumCap: Manufacturer: EPCOS; Model: B43305B9687M000; HelpURL: https://www.digikey.com/products/en?keywords=B43305B9687M000; ComponentKind: 400V; Value: 470 μF
C52 C54 = AlumCap: Manufacturer: Epcos; Model: B41851A5108M000; HelpURL: https://www.digikey.com/products/en?keywords=B41851A5108M000; ComponentKind: 25V; Value: 1000 μF
C56 C57 C66 C73 = Capacitor: Manufacturer: Yageo; Model: CC0805KRX7R9BB102; HelpURL: https://www.digikey.com/product-detail/en/yageo/CC0805KRX7R9BB102/311-1127-1-ND/303037; ComponentKind: X7R; Value: 1 nF
C62 = Capacitor: Manufacturer: EPCOS (TDK); Model: B32021A3472M; HelpURL: https://www.digikey.com/product-detail/en/epcos-tdk/B32021A3472M000/495-4082-ND/2045205; Value: 4.7 nF
C64 C65 C71 C72 = Capacitor: Manufacturer: Yageo; Model: CC1206KKX5R9BB106; HelpURL: https://www.digikey.com/product-detail/en/yageo/CC1206KKX5R9BB106/311-3449-1-ND/7164470; ComponentKind: X5R; Value: 10 μF
C69 C70 C75-C77 = Capacitor: Manufacturer: Yageo; Model: CC1206MKX5R7BB226; HelpURL: https://www.digikey.com/product-detail/en/yageo/CC1206MKX5R7BB226/311-1997-1-ND/5195899; ComponentKind: X5R; Value: 22 μF
D1 = ACS770LCB: Sensor; Manufacturer: Allegro MicroSystems, LLC; Model: ACS758ECB-200U-PFF-T; HelpURL: https://www.digikey.com/products/en?keywords=ACS758ECB-200U-PFF-T; ComponentKind: 20 mV/A
D2-D5 D8 D9 = MCP6001T: OP amplifier; Manufacturer: Microchip Technology; Model: MCP6001T-I/OT; HelpURL: https://www.digikey.com/product-detail/en/microchip-technology/MCP6001T-I-OT/MCP6001T-I-OTCT-ND/697158; ComponentKind: SOT23-5
D6 D10 = IR25750LTRPBF: Sensor; Manufacturer: Infineon Technologies; Model: IR25750LTRPBF; ComponentKind: SOT23-5; HelpURL: https://www.digikey.com/product-detail/en/infineon-technologies/IR25750LTRPBF/IR25750LTRPBFCT-ND/4743688
D7 D11 = UCC27322D: Low driver; Manufacturer: Texas Instruments; Model: UCC27322D; HelpURL: https://www.digikey.com/product-detail/en/texas-instruments/UCC37322D/296-13687-5-ND/509719; ComponentKind: 8-SOIC
D12 = UC3842BVD1R2G: AC-DC; Manufacturer: Texas Instruments; Model: UC3842BVD1R2G; HelpURL: https://www.digikey.com/product-detail/en/on-semiconductor/UC3842BVD1R2G/UC3842BVD1R2GOSCT-ND/5802572; ComponentKind: 8-SOIC
D13 D16 D17 = NCP1117LPST50T3G: LDO; Manufacturer: ON Semiconductor; ComponentKind: SOT-223
  D13 D16: Model: NCP1117ST50T3G; HelpURL: https://www.digikey.com/product-detail/en/on-semiconductor/NCP1117ST50T3G/NCP1117ST50T3GOSCT-ND/1967217
  D17: Model: NCV1117ST33T3G; HelpURL: https://www.digikey.com/product-detail/en/on-semiconductor/NCV1117ST33T3G/NCV1117ST33T3GOSCT-ND/2705186
D14 D15 = MC34063ADR: Sensor; Manufacturer: STMicroelectronics; Model: MC34063ACD-TR; HelpURL: https://www.digikey.com/product-detail/en/stmicroelectronics/MC34063ACD-TR/497-7850-1-ND/1883654; ComponentKind: 8-SOIC
FB1-FB3 = Inductor: Manufacturer: Murata Electronics North America; Model: BLM21PG121SN1D; HelpURL: https://www.digikey.com/product-detail/en/murata-electronics-north-america/BLM21PG121SN1D/490-5986-1-ND/3845186; ComponentKind: 0805; Value: 120R
L1 = Inductor ring: Manufacturer: Magnetics; Model: 0077439A7; Value: 500 μH; ComponentKind: 60 μ; HelpURL: http://ferrite.ru/warehouse/r-46-724-118-77439-a7.html
L2 L3 = Inductor: Manufacturer: Epcos; Model: B82477G4154M000; HelpURL: https://www.digikey.com/product-detail/en/epcos-tdk/B82477G4154M000/495-5685-1-ND/4245773; ComponentKind: B82477G4; Value: 150 μH
R1-R3 R65 = Resistor: Manufacturer: Yageo; Model: RC0805FR-07100KL; HelpURL: https://www.digikey.com/product-detail/en/yageo/RC0805FR-07100KL/311-100KCRCT-ND/730491; Value: 100k
R4 R5 R8 R10 R34 R36 R61 R66 R67 R73 = Resistor: Manufacturer: Yageo; Model: RC0805JR-071KL; HelpURL: https://www.digikey.com/product-detail/en/yageo/RC0805JR-071KL/311-1.0KARCT-ND/731165; ComponentKind: 0805; Value: 1k
R6 R7 R11 R33 R37 R70 = Resistor: Manufacturer: Yageo; Model: RC0805FR-0710KL; HelpURL: https://www.digikey.com/product-detail/en/yageo/RC0805FR-0710KL/311-10.0KCRCT-ND/730482; Value: 10k
R9 R35 = Resistor: Manufacturer: Yageo; Model: RC0805FR-076K8L; HelpURL: https://www.digikey.com/product-detail/en/yageo/RC0805FR-076K8L/311-6.80KCRCT-ND/731013; Value: 6k8
R12 R38 R80 R81 = Resistor: Manufacturer: Yageo; Model: RC0805FR-071KL; HelpURL: https://www.digikey.com/product-detail/en/yageo/RC0805FR-071KL/311-1.00KCRCT-ND/730391; Value: 1k
R13 R14 R23 R39 R40 R49 = Resistor: Manufacturer: Yageo; Model: RC0805JR-07100RL; HelpURL: https://www.digikey.com/product-detail/en/yageo/RC0805JR-07100RL/311-100ARCT-ND/731185; ComponentKind: 0805; Value: 100R
R15-R22 R41-R48 = Resistor: Manufacturer: Yageo; Model: RC0805JR-072R2L; HelpURL: https://www.digikey.com/product-detail/en/yageo/RC0805JR-072R2L/311-2.2ARCT-ND/731217; ComponentKind: 0805; Value: 2R2
R24-R32 R50-R58 R62 R64 R74 = Resistor: Manufacturer: Yageo; Model: RC0805JR-0710KL; HelpURL: https://www.digikey.com/product-detail/en/yageo/RC0805JR-0710KL/311-10KARCT-ND/731188; ComponentKind: 0805; Value: 10k
R59 R63 = Resistor: Manufacturer: Yageo; Model: RC0805FR-07560KL; HelpURL: https://www.digikey.com/product-detail/en/yageo/RC0805FR-07560KL/311-560KCRCT-ND/730984; Value: 560k
R60 = Resistor: Manufacturer: Yageo; Model: RC0805JR-07220RL; HelpURL: https://www.digikey.com/product-detail/en/yageo/RC0805JR-07220RL/311-220ARCT-ND/731230; ComponentKind: 0805; Value: 220R
R68 = Resistor: Manufacturer: Yageo; Model: RC0805JR-0718KL; HelpURL: https://www.digikey.com/product-detail/en/yageo/RC0805JR-0718KL/311-18KARCT-ND/731213; ComponentKind: 0805; Value: 18k
R69 = ADJ resistor: Manufacturer: Bourns Inc.; Model: 3296W-1-103LF; HelpURL: https://www.digikey.com/product-detail/en/bourns-inc/3296W-1-103LF/3296W-103LF-ND/1088045; ComponentKind: 3296W; Value: 10k
R71 = Resistor: Manufacturer: Yageo; Model: RC0805FR-0724KL; HelpURL: https://www.digikey.com/product-detail/en/yageo/RC0805FR-0724KL/311-24.0KCRCT-ND/730703; Value: 24k
R72 = Resistor: Manufacturer: Yageo; Model: RC0805JR-0751RL; HelpURL: https://www.digikey.com/product-detail/en/yageo/RC0805JR-0751RL/311-51ARCT-ND/731292; ComponentKind: 0805; Value: 51R
R75-R77 = Resistor: Manufacturer: Yageo; Model: PT1206FR-070R2L; HelpURL: https://www.digikey.com/product-detail/en/yageo/PT1206FR-070R2L/311-0.2ANCT-ND/2178372; Value: 0R2
R78 = Resistor: Manufacturer: Yageo; Model: RC0805FR-079K1L; HelpURL: https://www.digikey.com/product-detail/en/yageo/RC0805FR-079K1L/311-9.10KCRCT-ND/731134; Value: 9k1
R79 = Resistor: Manufacturer: Yageo; Model: RC0805FR-074K7L; HelpURL: https://www.digikey.com/product-detail/en/yageo/RC0805FR-074K7L/311-4.70KCRCT-ND/730876; Value: 4k7
T1 T4 = Push-Pull: Impulse; Manufacturer: Epcos; Model: ETD59/31/22; HelpURL: http://ferrite.ru/warehouse/etd-59-31-22-serdechnik-b66397g0000x187.html; ComponentKind: N87
T2 = Isolator: Impulse; Manufacturer: Ferroxcube; Model: EFD20/10/7; HelpURL: http://ferrite.ru/warehouse/efd20-10-7-karkas1sek10vyv-smd-cphs-efd-20-7-1s-10p.html; ComponentKind: CPHS-EFD20/7-1S-10P
U1 U2 = Optoisolator: Manufacturer: Lite-On Inc.; Model: LTV-817S; HelpURL: https://www.digikey.com/product-detail/en/lite-on-inc/LTV-817S/160-1367-5-ND/385837; ComponentKind: 4-SMD
VD1 = Diod Zener: Manufacturer: ON Semiconductor; ComponentKind: SOD-523; Model: ESD5Z3.3T1G; HelpURL: https://www.digikey.com/product-detail/en/on-semiconductor/ESD5Z3.3T1G/ESD5Z3.3T1GOSCT-ND/1967044
VD2 VD11-VD18 VD20 VD28 VD37-VD44 VD46 VD62 = Diod Schottky: Manufacturer: Fairchild/ON Semiconductor; ComponentKind: SOD-123F; Model: SS24FL; HelpURL: https://www.digikey.com/product-detail/en/fairchild-on-semiconductor/SS24FL/SS24FLCT-ND/5305093
VD3-VD10 VD29-VD36 = Diod Zener: Manufacturer: Fairchild/ON Semiconductor; ComponentKind: SMB; Model: SMBJ30A; HelpURL: https://www.digikey.com/product-detail/en/fairchild-on-semiconductor/SMBJ30A/SMBJ30AFSDKR-ND/2053288
VD19 VD21-VD27 VD45 VD47-VD53 VD63 = TVS-diod: Manufacturer: Littelfuse Inc.; Model: SD15C-01FTG; ComponentKind: SOD-323; HelpURL: https://www.digikey.com/product-detail/en/littelfuse-inc/SD15C-01FTG/F6444CT-ND/5019598
VD54 VD55 VD60 VD61 = Diod: Manufacturer: Infineon Technologies; ComponentKind: TO-220AC; Model: HFA15TB60PBF; HelpURL: https://www.digikey.com/product-detail/en/infineon-technologies/HFA15TB60PBF/IRHFA15TB60PBF-ND/5180758
VD56 VD59 VD64 VD65 = Diod Schottky: Manufacturer: ON Semiconductor; ComponentKind: SMB; Model: SS26T3G; HelpURL: https://www.digikey.com/product-detail/en/on-semiconductor/SS26T3G/SS26T3GOSCT-ND/964639
VD57 VD58 = Program Zener: Manufacturer: Texas Instruments; ComponentKind: SOT-23; Model: TL431AIDBZR; HelpURL: https://www.digikey.com/product-detail/en/texas-instruments/ATL431AIDBZR/296-42083-1-ND/5252836
VT1-VT16 = N-chanel: Mosfet; Manufacturer: Infineon Technologies; Model: IPP093N06N3GXKSA1; ComponentKind: TO-220; HelpURL: https://www.digikey.com/products/en?keywords=IPP093N06N3GXKSA1
VT17 = N-chanel: Mosfet; Manufacturer: Infineon Technologies; Model: IRF7853PBF; ComponentKind: SO-8; HelpURL: https://www.digikey.com/products/en?keywords=IRF7853PBF
X1 X2 = 1-Connector: Manufacturer: Wurth Electronics Inc.; Model: 7461383; HelpURL: https://www.digikey.com/products/en?keywords=7461383; ComponentKind: 160А

## Sheet Page 2.SchDoc
size 594 x 420 mm; Address1: Address1; Address2: Address2; Address3: Address3; Address4: Address4; DocumentNumber: НЭС.185014.2017-5.1; SheetNumber: 2; SheetTotal: 3; Scale: 1:1; DocumentType: Схема электрическая принципиальная; FirstReferrence: НЭС.185014.2017-5.1
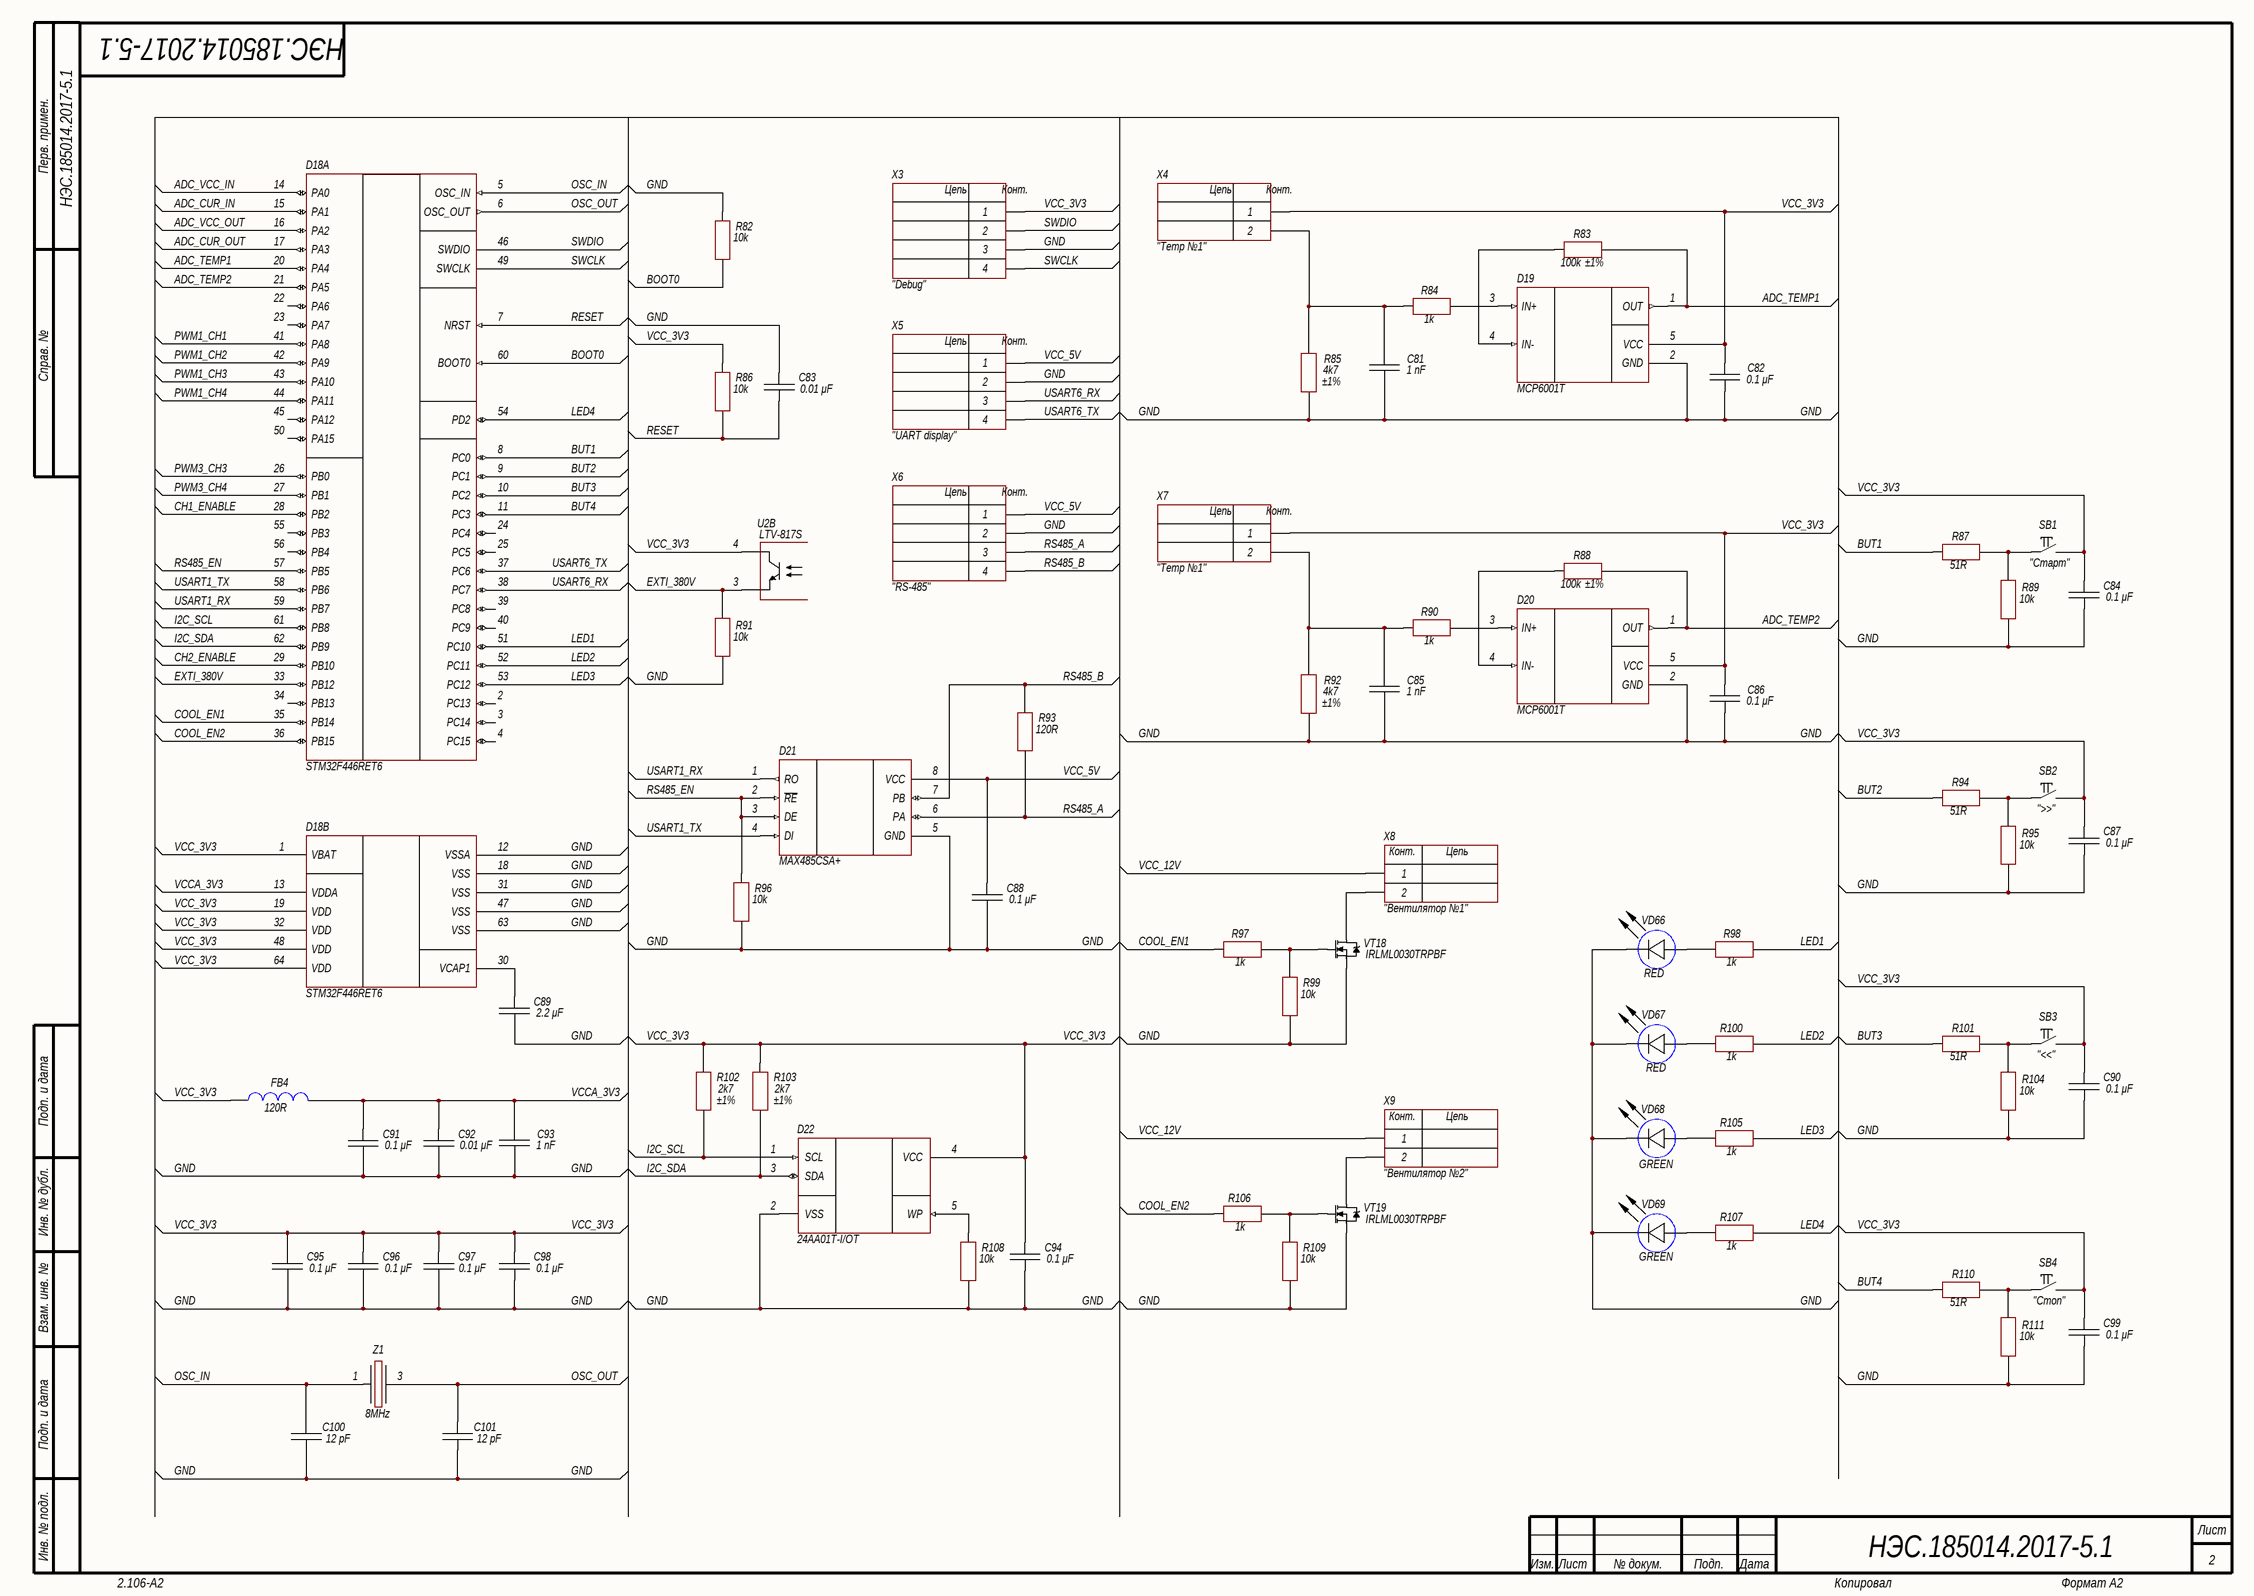
[diagram p6: Page 2.SchDoc]

### Parts
C81  1 nF  [CH0805C]
C82  0.1 μF  [CH0805C]
C83  0.01 μF  [CH0805C]
C84  0.1 μF  [CH0805C]
C85  1 nF  [CH0805C]
C86  0.1 μF  [CH0805C]
C87  0.1 μF  [CH0805C]
C88  0.1 μF  [CH0805C]
C89  2.2 μF  [CH0805C]
C90  0.1 μF  [CH0805C]
C91  0.1 μF  [CH0805C]
C92  0.01 μF  [CH0805C]
C93  1 nF  [CH0805C]
C94  0.1 μF  [CH0805C]
C95  0.1 μF  [CH0805C]
C96  0.1 μF  [CH0805C]
C97  0.1 μF  [CH0805C]
C98  0.1 μF  [CH0805C]
C99  0.1 μF  [CH0805C]
C100  12 pF  [CH0805C]
C101  12 pF  [CH0805C]
D18  STM32F446RET6  [64-LQFP]  (parts A,B of 2)
D19  MCP6001T  [SOT23-5]
D20  MCP6001T  [SOT23-5]
D21  MAX485CSA+  [8-SOIC]
D22  24AA01T-I/OT  [SOT23-5]
FB4  120R  [CH0805L]
R82  10k  [CH0805R]
R83  100k  ComponentKind: ±1%  [CH0805R]
R84  1k  [CH0805R]
R85  4k7  ComponentKind: ±1%  [CH0805R]
R86  10k  [CH0805R]
R87  51R  [CH0805R]
R88  100k  ComponentKind: ±1%  [CH0805R]
R89  10k  [CH0805R]
R90  1k  [CH0805R]
R91  10k  [CH0805R]
R92  4k7  ComponentKind: ±1%  [CH0805R]
R93  120R  [CH0805R]
R94  51R  [CH0805R]
R95  10k  [CH0805R]
R96  10k  [CH0805R]
R97  1k  [CH0805R]
R98  1k  [CH0805R]
R99  10k  [CH0805R]
R100  1k  [CH0805R]
R101  51R  [CH0805R]
R102  2k7  ComponentKind: ±1%  [CH0805R]
R103  2k7  ComponentKind: ±1%  [CH0805R]
R104  10k  [CH0805R]
R105  1k  [CH0805R]
R106  1k  [CH0805R]
R107  1k  [CH0805R]
R108  10k  [CH0805R]
R109  10k  [CH0805R]
R110  51R  [CH0805R]
R111  10k  [CH0805R]
SB1  "Старт"  [BUT: 6x6 SMD]
SB2  ">>"  [BUT: 6x6 SMD]
SB3  "<<"  [BUT: 6x6 SMD]
SB4  "Стоп"  [BUT: 6x6 SMD]
U2  LTV-817S  [4-SMD]  (part B of 2)
VD66  RED  [CH0805LR]
VD67  RED  [CH0805LR]
VD68  GREEN  [CH0805LG]
VD69  GREEN  [CH0805LG]
VT18  IRLML0030TRPBF  [SOT23_123]
VT19  IRLML0030TRPBF  [SOT23_123]
X3  "Debug"  [CON: PLD-4]
X4  "Temp №1"  [CON: WF-02]
X5  "UART display"  [CON: WF-04]
X6  "RS-485"  [CON: WF-04]
X7  "Temp №1"  [CON: WF-02]
X8  "Вентилятор №1"  [CON: WF-02]
X9  "Вентилятор №2"  [CON: WF-02]
Z1  8MHz  [OSC: 5032]

### Nets
GND: C81.1 C82.1 C83.2 C84.1 C85.1 C86.1 C87.1 C88.1 C89.1 C90.1 C91.1 C92.1 C93.1 C94.1 C95.1 C96.1 C97.1 C98.1 C99.1 C100.1 C101.1 D18.12(VSSA) D18.18(VSS) D18.31(VSS) D18.47(VSS) D18.63(VSS) D19.2(GND) D20.2(GND) D21.5(GND) D22.2(VSS) R82.2 R85.1 R89.1 R91.1 R92.1 R95.1 R96.1 R99.1 R104.1 R108.1 R109.1 R111.1 VD66.2(C) VD67.2(C) VD68.2(C) VD69.2(C) VT18.3(S) VT19.3(S) X3.3 X5.2 X6.2
VCC_3V3: C82.2 C84.2 C86.2 C87.2 C90.2 C94.2 C95.2 C96.2 C97.2 C98.2 C99.2 D18.1(VBAT) D18.19(VDD) D18.32(VDD) D18.48(VDD) D18.64(VDD) D19.5(VCC) D20.5(VCC) D22.4(VCC) FB4.2 R86.2 R102.1 R103.1 SB1.2 SB2.2 SB3.2 SB4.2 U2.4(C) X3.1 X4.1 X7.1
VCC_5V: C88.2 D21.8(VCC) X5.1 X6.1
VCC_12V: X8.1 X9.1
ADC_CUR_IN: D18.15(PA1)
ADC_CUR_OUT: D18.17(PA3)
ADC_TEMP1: D18.20(PA4) D19.1(OUT) R83.2
ADC_TEMP2: D18.21(PA5) D20.1(OUT) R88.2
ADC_VCC_IN: D18.14(PA0)
ADC_VCC_OUT: D18.16(PA2)
BOOT0: D18.60(BOOT0) R82.1
BUT1: D18.8(PC0) R87.2
BUT2: D18.9(PC1) R94.2
BUT3: D18.10(PC2) R101.2
BUT4: D18.11(PC3) R110.2
CH1_ENABLE: D18.28(PB2)
CH2_ENABLE: D18.29(PB10)
COOL_EN1: D18.35(PB14) R97.2
COOL_EN2: D18.36(PB15) R106.2
EXTI_380V: D18.33(PB12) R91.2 U2.3(E)
I2C_SCL: D18.61(PB8) D22.1(SCL) R102.2
I2C_SDA: D18.62(PB9) D22.3(SDA) R103.2
LED1: D18.51(PC10) R98.1
LED2: D18.52(PC11) R100.1
LED3: D18.53(PC12) R105.1
LED4: D18.54(PD2) R107.1
OSC_IN: C100.2 D18.5(OSC_IN) Z1.1
OSC_OUT: C101.2 D18.6(OSC_OUT) Z1.3
PWM1_CH1: D18.41(PA8)
PWM1_CH2: D18.42(PA9)
PWM1_CH3: D18.43(PA10)
PWM1_CH4: D18.44(PA11)
PWM3_CH3: D18.26(PB0)
PWM3_CH4: D18.27(PB1)
RESET: C83.1 D18.7(NRST) R86.1
RS485_A: D21.6(PA) R93.1 X6.3
RS485_B: D21.7(PB) R93.2 X6.4
RS485_EN: D18.57(PB5) D21.2(~{RE}) D21.3(DE) R96.2
SWCLK: D18.49(SWCLK) X3.4
SWDIO: D18.46(SWDIO) X3.2
USART1_RX: D18.59(PB7) D21.1(RO)
USART1_TX: D18.58(PB6) D21.4(DI)
USART6_RX: D18.38(PC7) X5.3
USART6_TX: D18.37(PC6) X5.4
VCCA_3V3: C91.2 C92.2 C93.2 D18.13(VDDA) FB4.1
NetC81_2: C81.2 R84.2 R85.2 X4.2
NetC85_2: C85.2 R90.2 R92.2 X7.2
NetC89_2: C89.2 D18.30(VCAP1)
NetD19_3: D19.3(IN+) R84.1
NetD19_4: D19.4(IN-) R83.1
NetD20_3: D20.3(IN+) R90.1
NetD20_4: D20.4(IN-) R88.1
NetD22_5: D22.5(WP) R108.2
NetR87_1: R87.1 R89.2 SB1.1
NetR94_1: R94.1 R95.2 SB2.1
NetR97_1: R97.1 R99.2 VT18.1(G)
NetR98_2: R98.2 VD66.1(A)
NetR100_2: R100.2 VD67.1(A)
NetR101_1: R101.1 R104.2 SB3.1
NetR105_2: R105.2 VD68.1(A)
NetR106_1: R106.1 R109.2 VT19.1(G)
NetR107_2: R107.2 VD69.1(A)
NetR110_1: R110.1 R111.2 SB4.1
NetVT18_2: VT18.2(D) X8.2
NetVT19_2: VT19.2(D) X9.2

Not connected (* = marked no-connect by the designer): D18 2(PC13) 3(PC14) 4(PC15) 22(PA6) 23(PA7) 24(PC4) 25(PC5) 34(PB13) 39(PC8) 40(PC9) 45(PA12) 50(PA15) 55(PB3) 56(PB4)

### Notes on the sheet
- Перв. примен.
- Справ. №
- Подп. и дата
- Инв. № дубл.
- Взам. инв. №
- Инв. № подл.
- Изм.
- Лист
- № докум.
- Подп.
- Дата
- 2.106-A2
- Копировал
- Формат А2
- (in symbol 2-Connector) Цепь; Конт.
- (in symbol 4-Connector) Цепь; Конт.

### Library data of the parts
C81 C85 C93 = Capacitor: as C56 on sheet Page 1; HelpURL: https://www.digikey.com/product-detail/en/yageo/CC0805KRX7R9BB102/311-1127-1-ND/303037; ComponentKind: X7R; Value: 1 nF
C82-C84 C86-C88 C90-C92 C94-C99 = Capacitor: as C22 on sheet Page 1; HelpURL: https://www.digikey.com/product-detail/en/yageo/CC0805KRX7R8BB104/311-1141-1-ND/303051; ComponentKind: X7R
  C82 C84 C86-C88 C90 C91 C94-C99: Value: 0.1 μF
  C83 C92: Value: 0.01 μF
C89 = Capacitor: Manufacturer: Yageo; Model: CC0805KKX7R6BB225; HelpURL: https://www.digikey.com/product-detail/en/yageo/CC0805KKX7R6BB225/311-1368-1-ND/2103152; ComponentKind: X7R; Value: 2.2 μF
C100 C101 = Capacitor: Manufacturer: Yageo; Model: CC0805JRNPO9BN120; HelpURL: https://www.digikey.com/product-detail/en/yageo/CC0805JRNPO9BN120/311-1100-1-ND/303010; ComponentKind: NP0; Value: 12 pF
D18 = STM32F446RET6: Cortex-M4; Manufacturer: STMicroelectronics; Model: STM32F446RET6; HelpURL: https://www.digikey.com/product-detail/en/stmicroelectronics/STM32F446RET6/497-15376-ND/5175962; ComponentKind: 64-LQFP
D19 D20 = MCP6001T: as D2 on sheet Page 1; HelpURL: https://www.digikey.com/product-detail/en/microchip-technology/MCP6001T-I-OT/MCP6001T-I-OTCT-ND/697158; ComponentKind: SOT23-5
D21 = MAX485CSA+: RS485; Manufacturer: Maxim Integrated; Model: MAX485CSA+; HelpURL: https://www.digikey.com/product-detail/en/maxim-integrated/MAX485CSA/MAX485CSA-ND/948027; ComponentKind: 8-SOIC
D22 = 24AA01T-I/OT: EEPROM; Manufacturer: Microchip Technology; Model: 24AA01T-I/OT; HelpURL: https://www.digikey.com/product-detail/en/microchip-technology/24AA01T-I-OT/24AA01T-I-OTCT-ND/857670; ComponentKind: SOT23-5
FB4 = Inductor: as FB1 on sheet Page 1; HelpURL: https://www.digikey.com/product-detail/en/murata-electronics-north-america/BLM21PG121SN1D/490-5986-1-ND/3845186; ComponentKind: 0805; Value: 120R
R82 R86 R89 R91 R95 R96 R99 R104 R108 R109 R111 = Resistor: as R24 on sheet Page 1; HelpURL: https://www.digikey.com/product-detail/en/yageo/RC0805JR-0710KL/311-10KARCT-ND/731188; ComponentKind: 0805; Value: 10k
R83 R88 = Resistor: as R1 on sheet Page 1; HelpURL: https://www.digikey.com/product-detail/en/yageo/RC0805FR-07100KL/311-100KCRCT-ND/730491; Value: 100k
R84 R90 R97 R98 R100 R105-R107 = Resistor: as R4 on sheet Page 1; HelpURL: https://www.digikey.com/product-detail/en/yageo/RC0805JR-071KL/311-1.0KARCT-ND/731165; ComponentKind: 0805; Value: 1k
R85 R92 = Resistor: as R79 on sheet Page 1; HelpURL: https://www.digikey.com/product-detail/en/yageo/RC0805FR-074K7L/311-4.70KCRCT-ND/730876; Value: 4k7
R87 R94 R101 R110 = Resistor: as R72 on sheet Page 1; HelpURL: https://www.digikey.com/product-detail/en/yageo/RC0805JR-0751RL/311-51ARCT-ND/731292; ComponentKind: 0805; Value: 51R
R93 = Resistor: Manufacturer: Yageo; Model: RC0805JR-07120RL; HelpURL: https://www.digikey.com/product-detail/en/yageo/RC0805JR-07120RL/311-120ARCT-ND/731194; ComponentKind: 0805; Value: 120R
R102 R103 = Resistor: Manufacturer: Yageo; Model: RC0805FR-072K7L; HelpURL: https://www.digikey.com/product-detail/en/yageo/RC0805FR-072K7L/311-2.70KCRCT-ND/730653; Value: 2k7
SB1-SB4 = Tactile switches: 6x6 mm; Manufacturer: KLS; Model: L-KLS7-TS6604-4.3-180-B; HelpURL: https://www.chipdip.ru/product/kls7-ts6604-4.3-180-b-it-1102s; ComponentKind: 6x6mm
U2 = Optoisolator: Manufacturer: Lite-On Inc.; Model: LTV-817S; HelpURL: https://www.digikey.com/product-detail/en/lite-on-inc/LTV-817S/160-1367-5-ND/385837; ComponentKind: 4-SMD
VD66 VD67 = LED: Manufacturer: Lite-On Inc.; Model: LTST-C171KRKT; HelpURL: https://www.digikey.com/product-detail/en/lite-on-inc/LTST-C171KRKT/160-1427-1-ND/386800; ComponentKind: 0805; Value: RED
VD68 VD69 = LED: Manufacturer: Lite-On Inc.; Model: LTST-C171GKT; HelpURL: https://www.digikey.com/product-detail/en/lite-on-inc/LTST-C171GKT/160-1423-1-ND/386792; ComponentKind: 0805; Value: GREEN
VT18 VT19 = N-chanel: as VT17 on sheet Page 1; Model: IRLML0030TRPBF; ComponentKind: SOT-23; HelpURL: https://www.digikey.com/product-detail/en/infineon-technologies/IRLML0030TRPBF/IRLML0030TRPBFCT-ND/2202231
X3 = 4-Connector: Model: PLD-4; Manufacturer: *; HelpURL: *; ComponentKind: *
X4 X7-X9 = 2-Connector: Model: WF-02; Manufacturer: *; HelpURL: *; ComponentKind: *
X5 X6 = 4-Connector: Model: WF-04; Manufacturer: *; HelpURL: *; ComponentKind: *
Z1 = Oscillator: Manufacturer: Geyer; Model: KX-9A; HelpURL: http://www.electronshik.ru/item/kx-9a-80-mhz-209499; ComponentKind: 5032; Value: 8MHz

## Sheet Page 3.SchDoc
size 840 x 594 mm; Address1: Address1; Address2: Address2; Address3: Address3; Address4: Address4; DocumentNumber: НЭС.185014.2017-5.1; SheetNumber: 3; SheetTotal: 3; Scale: 1:1; DocumentType: Схема электрическая принципиальная; FirstReferrence: НЭС.185014.2017-5.1
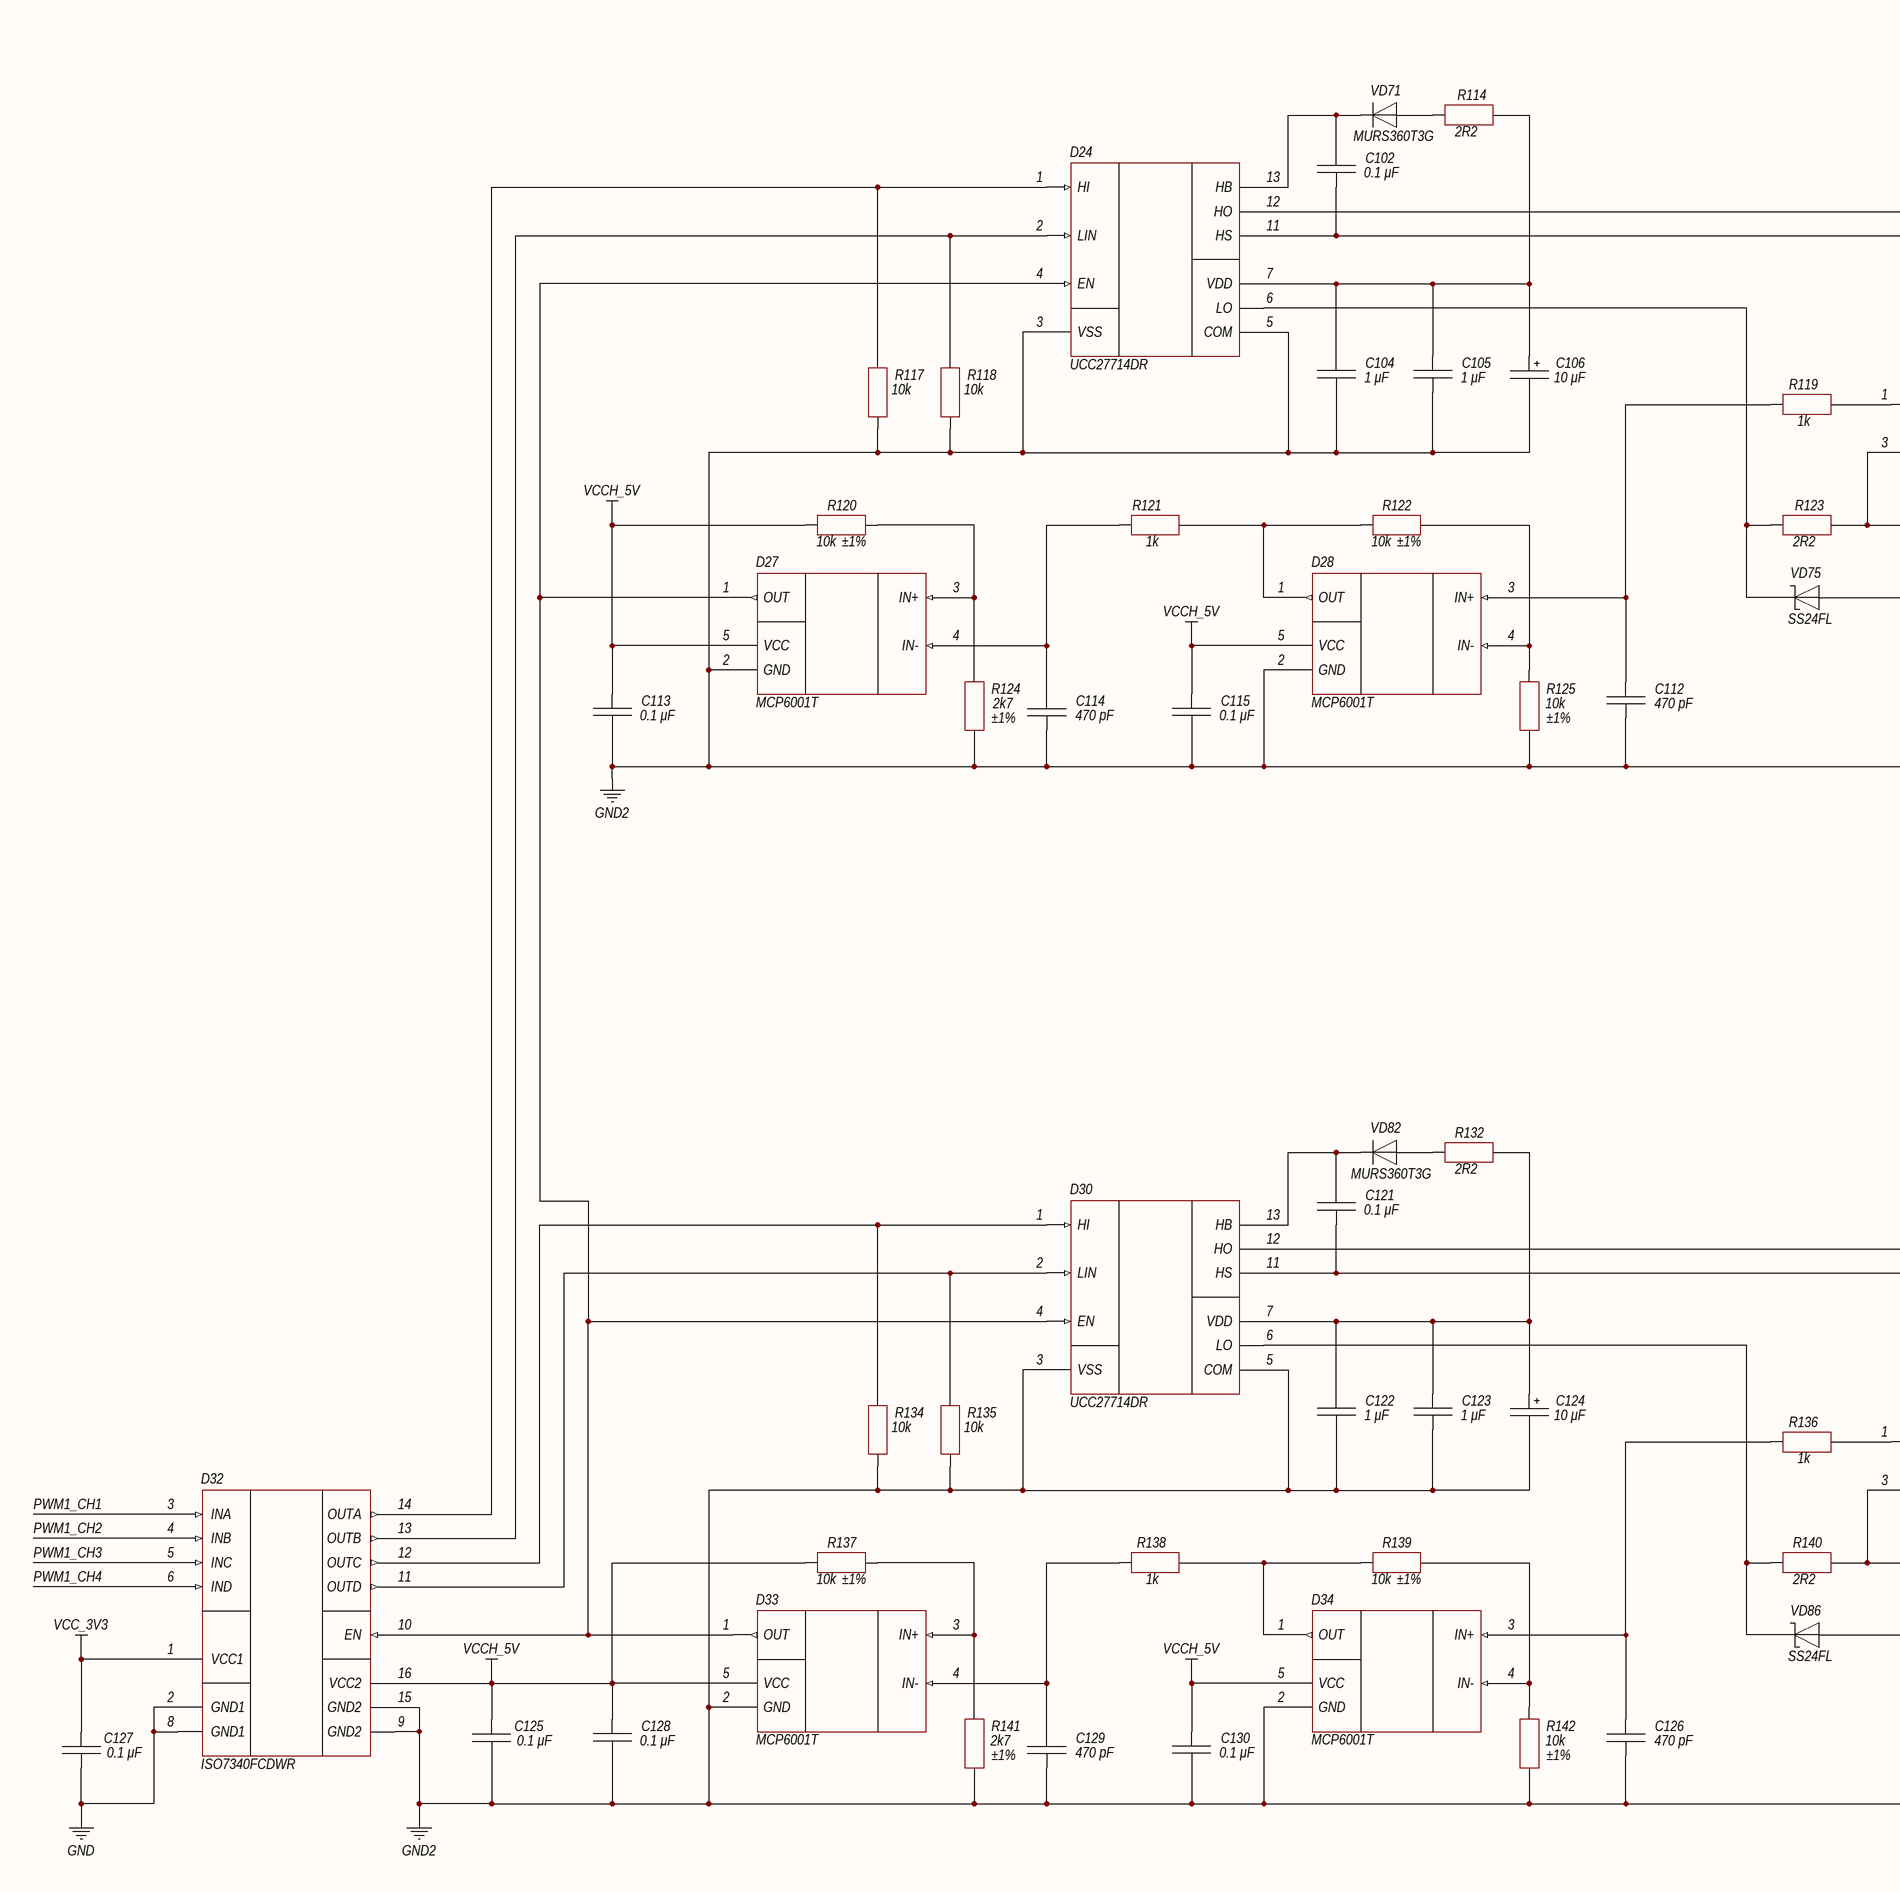
[diagram p7: Page 3.SchDoc, left]
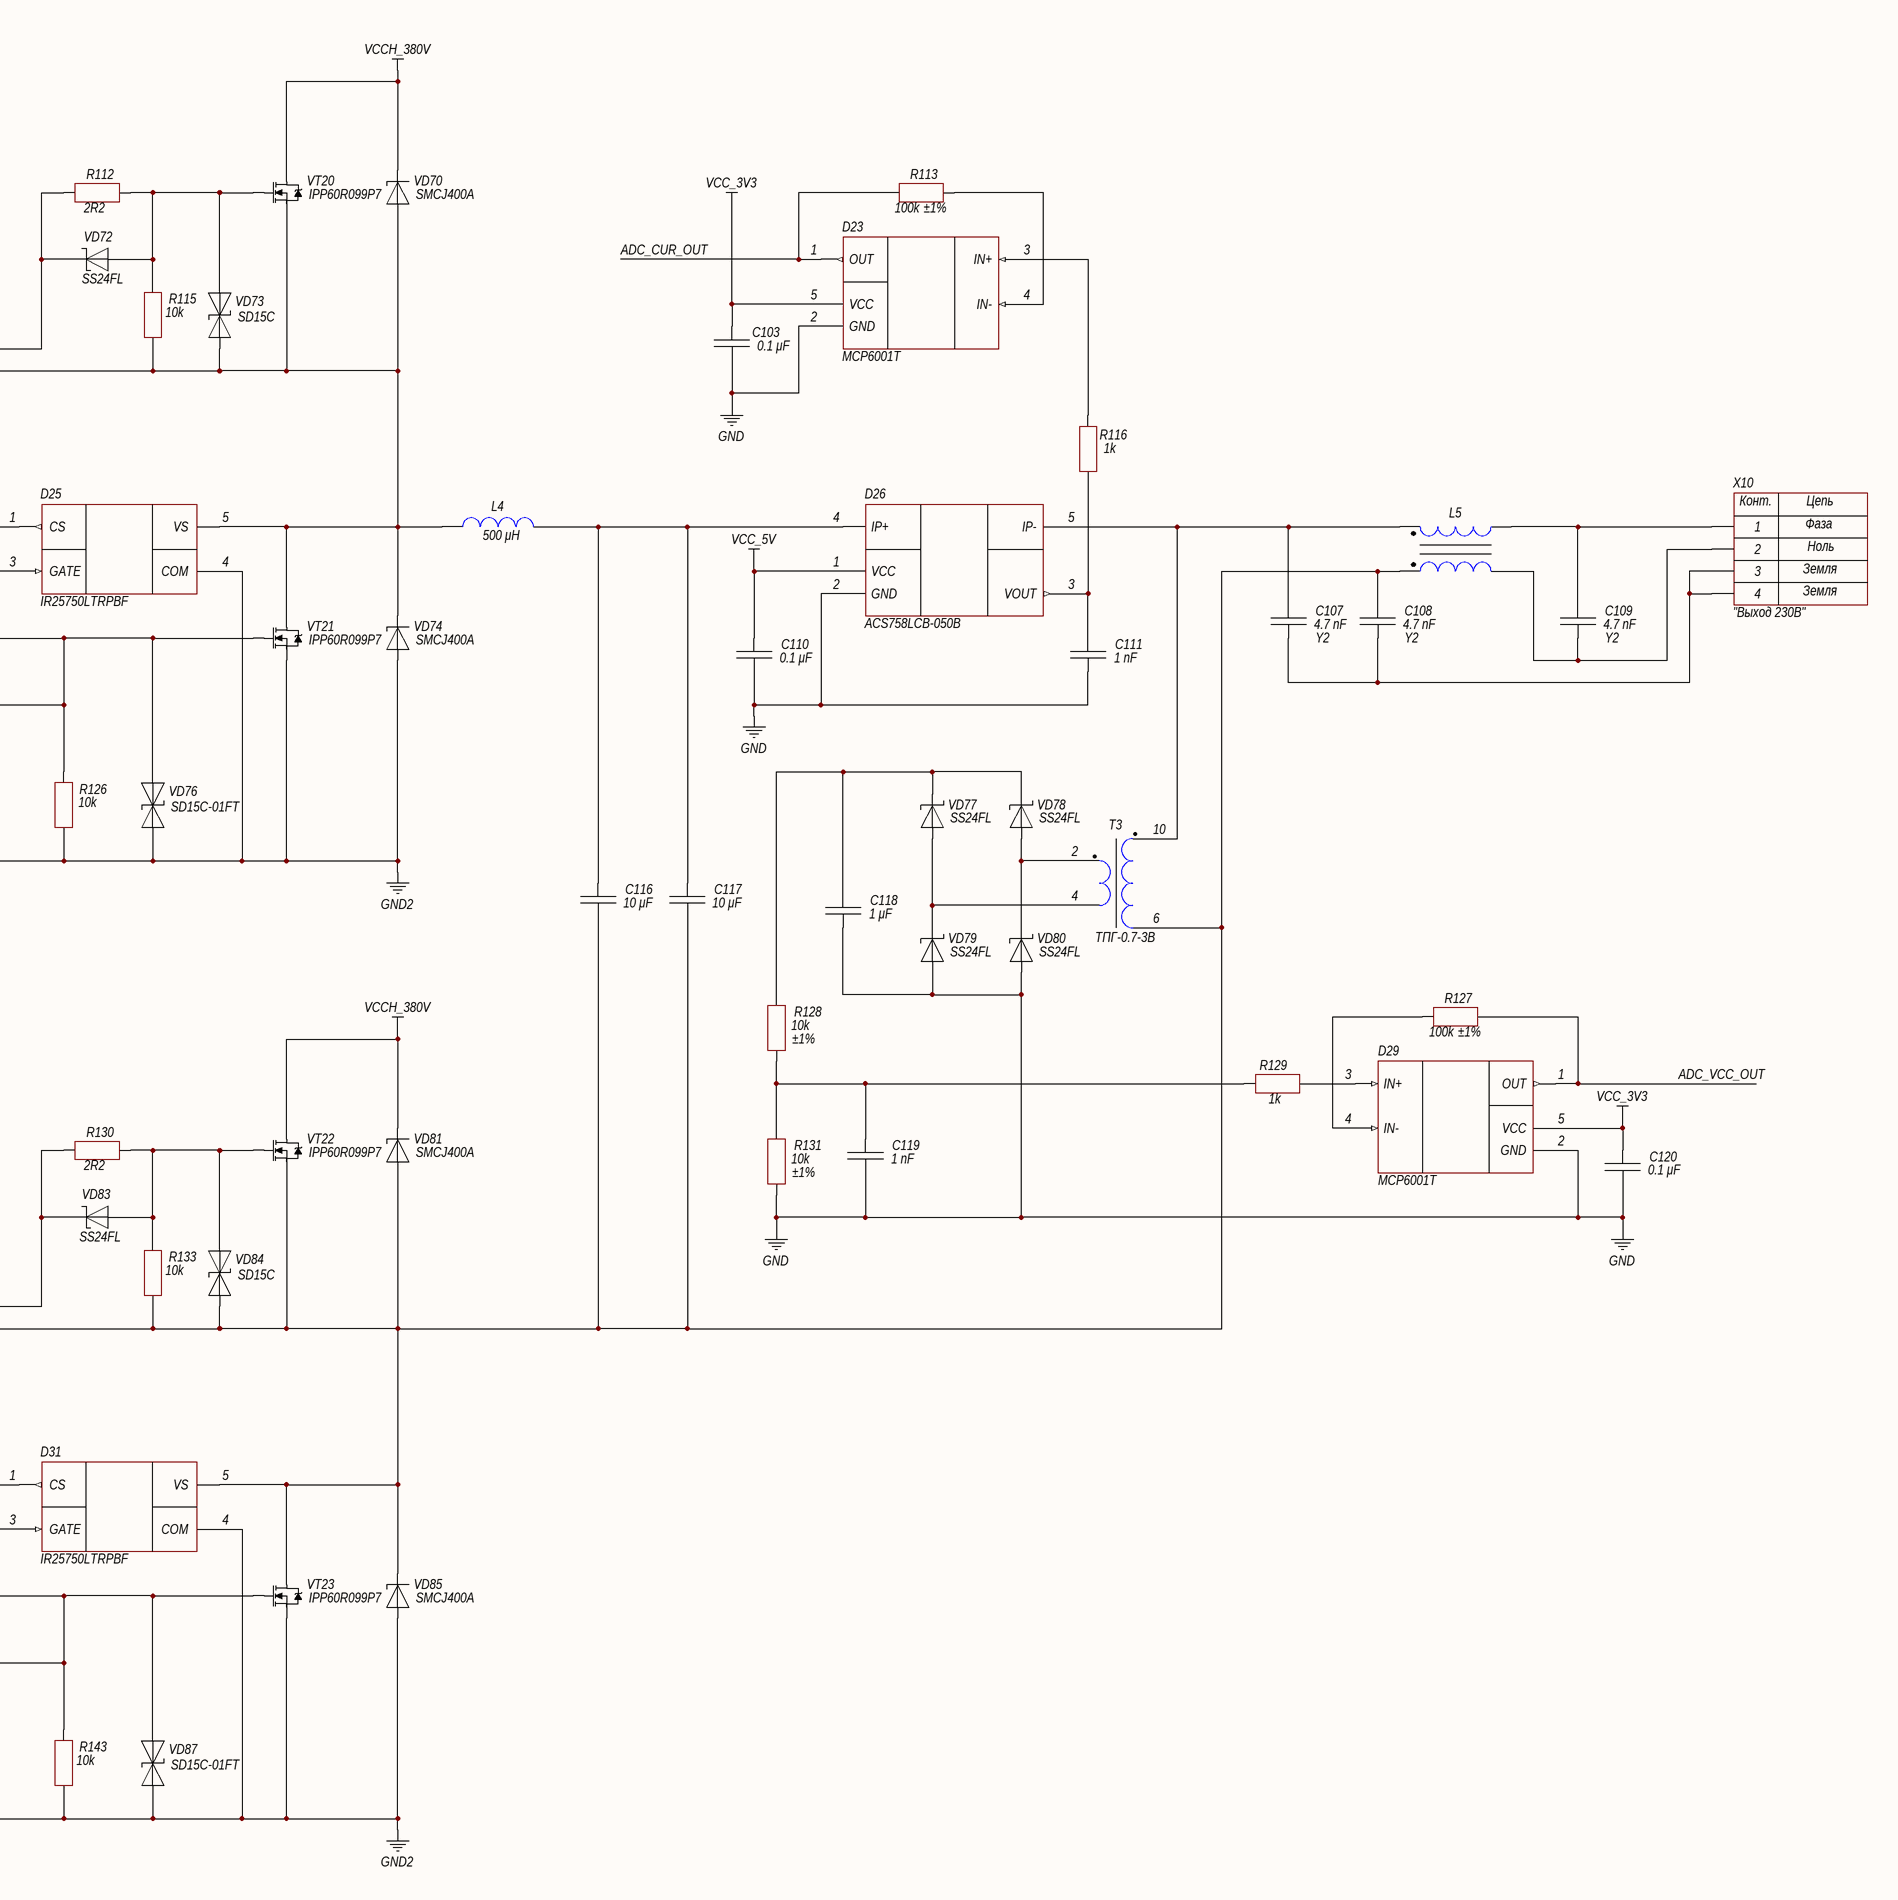
[diagram p8: Page 3.SchDoc, right]

### Parts
C102  0.1 μF  [CH0805C]
C103  0.1 μF  [CH0805C]
C104  1 μF  [CH0805C]
C105  1 μF  [CH0805C]
C106  10 μF  [TANTAL_C]
C107  4.7 nF  ComponentKind: Y2  [CAP: B32021]
C108  4.7 nF  ComponentKind: Y2  [CAP: B32021]
C109  4.7 nF  ComponentKind: Y2  [CAP: B32021]
C110  0.1 μF  [CH0805C]
C111  1 nF  [CH0805C]
C112  470 pF  [CH0805C]
C113  0.1 μF  [CH0805C]
C114  470 pF  [CH0805C]
C115  0.1 μF  [CH0805C]
C116  10 μF  [CAP: B32676]
C117  10 μF  [CAP: B32676]
C118  1 μF  [CH0805C]
C119  1 nF  [CH0805C]
C120  0.1 μF  [CH0805C]
C121  0.1 μF  [CH0805C]
C122  1 μF  [CH0805C]
C123  1 μF  [CH0805C]
C124  10 μF  [TANTAL_C]
C125  0.1 μF  [CH0805C]
C126  470 pF  [CH0805C]
C127  0.1 μF  [CH0805C]
C128  0.1 μF  [CH0805C]
C129  470 pF  [CH0805C]
C130  0.1 μF  [CH0805C]
D23  MCP6001T  [SOT23-5]
D24  UCC27714DR  [14-SOIC]
D25  IR25750LTRPBF  [SOT23-5]
D26  ACS758LCB-050B  [IC: ACS770]
D27  MCP6001T  [SOT23-5]
D28  MCP6001T  [SOT23-5]
D29  MCP6001T  [SOT23-5]
D30  UCC27714DR  [14-SOIC]
D31  IR25750LTRPBF  [SOT23-5]
D32  ISO7340FCDWR  [16-SOIC (W)]
D33  MCP6001T  [SOT23-5]
D34  MCP6001T  [SOT23-5]
L4  500 μH  [IND: R46]
L5  0077071A7  [IND: R32]  (value not drawn)
R112  2R2  [CH0805R]
R113  100k  ComponentKind: ±1%  [CH0805R]
R114  2R2  [CH0805R]
R115  10k  [CH0805R]
R116  1k  [CH0805R]
R117  10k  [CH0805R]
R118  10k  [CH0805R]
R119  1k  [CH0805R]
R120  10k  ComponentKind: ±1%  [CH0805R]
R121  1k  [CH0805R]
R122  10k  ComponentKind: ±1%  [CH0805R]
R123  2R2  [CH0805R]
R124  2k7  ComponentKind: ±1%  [CH0805R]
R125  10k  ComponentKind: ±1%  [CH0805R]
R126  10k  [CH0805R]
R127  100k  ComponentKind: ±1%  [CH0805R]
R128  10k  ComponentKind: ±1%  [CH0805R]
R129  1k  [CH0805R]
R130  2R2  [CH0805R]
R131  10k  ComponentKind: ±1%  [CH0805R]
R132  2R2  [CH0805R]
R133  10k  [CH0805R]
R134  10k  [CH0805R]
R135  10k  [CH0805R]
R136  1k  [CH0805R]
R137  10k  ComponentKind: ±1%  [CH0805R]
R138  1k  [CH0805R]
R139  10k  ComponentKind: ±1%  [CH0805R]
R140  2R2  [CH0805R]
R141  2k7  ComponentKind: ±1%  [CH0805R]
R142  10k  ComponentKind: ±1%  [CH0805R]
R143  10k  [CH0805R]
T3  ТПГ-0.7-3В  [TRANS: ТПК-7]
VD70  SMCJ400A  [SMC]
VD71  MURS360T3G  [SMC]
VD72  SS24FL  [SOD123F]
VD73  SD15C  [SOD323]
VD74  SMCJ400A  [SMC]
VD75  SS24FL  [SOD123F]
VD76  SD15C-01FT  [SOD323]
VD77  SS24FL  [SOD123F]
VD78  SS24FL  [SOD123F]
VD79  SS24FL  [SOD123F]
VD80  SS24FL  [SOD123F]
VD81  SMCJ400A  [SMC]
VD82  MURS360T3G  [SMC]
VD83  SS24FL  [SOD123F]
VD84  SD15C  [SOD323]
VD85  SMCJ400A  [SMC]
VD86  SS24FL  [SOD123F]
VD87  SD15C-01FT  [SOD323]
VT20  IPP60R099P7  [TO220_123]
VT21  IPP60R099P7  [TO220_123]
VT22  IPP60R099P7  [TO220_123]
VT23  IPP60R099P7  [TO220_123]
X10  "Выход 230В"  [CON: X977B04]

### Nets
GND: C103.1 C110.1 C111.1 C118.1 C119.1 C120.1 C127.1 D23.2(GND) D26.2(GND) D29.2(GND) D32.2(GND1) D32.8(GND1) R131.2 VD79.1 VD80.1
GND2: C104.1 C105.1 C106.2 C112.2 C113.1 C114.2 C115.1 C122.1 C123.1 C124.2 C125.1 C126.2 C128.1 C129.2 C130.1 D24.3(VSS) D24.5(COM) D25.4(COM) D27.2(GND) D28.2(GND) D30.3(VSS) D30.5(COM) D31.4(COM) D32.9(GND2) D32.15(GND2) D33.2(GND) D34.2(GND) R117.1 R118.1 R124.2 R125.2 R126.1 R134.1 R135.1 R141.2 R142.2 R143.1 VD74.1(A) VD76.1(A) VD85.1(A) VD87.1(A) VT21.3(S) VT23.3(S)
VCC_3V3: C103.2 C120.2 C127.2 D23.5(VCC) D29.5(VCC) D32.1(VCC1)
VCC_5V: C110.2 D26.1(VCC)
VCCH_5V: C113.2 C115.2 C125.2 C128.2 C130.2 D27.5(VCC) D28.5(VCC) D32.16(VCC2) D33.5(VCC) D34.5(VCC) R120.2 R137.2
VCCH_380V: VD70.2(C) VD81.2(C) VT20.2(D) VT22.2(D)
ADC_CUR_OUT: D23.1(OUT) R113.1
ADC_VCC_OUT: D29.1(OUT) R127.2
PWM1_CH1: D32.3(INA)
PWM1_CH2: D32.4(INB)
PWM1_CH3: D32.5(INC)
PWM1_CH4: D32.6(IND)
NetC102_1: C102.1 D24.11(HS) D25.5(VS) L4.2 R115.1 VD70.1(A) VD73.1(A) VD74.2(C) VT20.3(S) VT21.2(D)
NetC102_2: C102.2 D24.13(HB) VD71.2
NetC104_2: C104.2 C105.2 C106.1 D24.7(VDD) R114.1
NetC107_1: C107.1 C108.1 X10.3 X10.4
NetC107_2: C107.2 D26.5(IP-) L5.1 T3.10
NetC108_2: C108.2 C116.1 C117.1 C121.1 D30.11(HS) D31.5(VS) L5.3 R133.1 T3.6 VD81.1(A) VD84.1(A) VD85.2(C) VT22.3(S) VT23.2(D)
NetC109_1: C109.1 L5.4 X10.2
NetC109_2: C109.2 L5.2 X10.1
NetC111_2: C111.2 D26.3(VOUT) R116.2
NetC112_1: C112.1 D28.3(IN+) R119.1
NetC114_1: C114.1 D27.4(IN-) R121.2
NetC116_2: C116.2 C117.2 D26.4(IP+) L4.1
NetC118_2: C118.2 R128.1 VD77.2 VD78.2
NetC119_2: C119.2 R128.2 R129.2 R131.1
NetC121_2: C121.2 D30.13(HB) VD82.2
NetC122_2: C122.2 C123.2 C124.1 D30.7(VDD) R132.1
NetC126_1: C126.1 D34.3(IN+) R136.1
NetC129_1: C129.1 D33.4(IN-) R138.2
NetD23_3: D23.3(IN+) R116.1
NetD23_4: D23.4(IN-) R113.2
NetD24_1: D24.1(HI) D32.14(OUTA) R117.2
NetD24_2: D24.2(LIN) D32.13(OUTB) R118.2
NetD24_4: D24.4(EN) D27.1(OUT) D30.4(EN) D32.10(EN) D33.1(OUT)
NetD24_6: D24.6(LO) R123.2 VD75.2
NetD24_12: D24.12(HO) R112.2 VD72.2
NetD25_1: D25.1(CS) R119.2
NetD25_3: D25.3(GATE) R123.1 R126.2 VD75.1 VD76.2(C) VT21.1(G)
NetD27_3: D27.3(IN+) R120.1 R124.1
NetD28_1: D28.1(OUT) R121.1 R122.1
NetD28_4: D28.4(IN-) R122.2 R125.1
NetD29_3: D29.3(IN+) R129.1
NetD29_4: D29.4(IN-) R127.1
NetD30_1: D30.1(HI) D32.12(OUTC) R134.2
NetD30_2: D30.2(LIN) D32.11(OUTD) R135.2
NetD30_6: D30.6(LO) R140.2 VD86.2
NetD30_12: D30.12(HO) R130.2 VD83.2
NetD31_1: D31.1(CS) R136.2
NetD31_3: D31.3(GATE) R140.1 R143.2 VD86.1 VD87.2(C) VT23.1(G)
NetD33_3: D33.3(IN+) R137.1 R141.1
NetD34_1: D34.1(OUT) R138.1 R139.1
NetD34_4: D34.4(IN-) R139.2 R142.1
NetR112_1: R112.1 R115.2 VD72.1 VD73.2(C) VT20.1(G)
NetR114_2: R114.2 VD71.1
NetR130_1: R130.1 R133.2 VD83.1 VD84.2(C) VT22.1(G)
NetR132_2: R132.2 VD82.1
NetT3_2: T3.2 VD78.1 VD80.2
NetT3_4: T3.4 VD77.1 VD79.2

### Notes on the sheet
- Фаза
- Ноль
- Земля
- Перв. примен.
- Справ. №
- Подп. и дата
- Инв. № дубл.
- Взам. инв. №
- Инв. № подл.
- Изм.
- Лист
- № докум.
- Подп.
- Дата
- 2.106-A2
- Копировал
- Формат А1
- (in symbol 4-Connector) Конт.; Цепь

### Library data of the parts
C102 C103 C110 C113 C115 C120 C121 C125 C127 C128 C130 = Capacitor: as C22 on sheet Page 1; HelpURL: https://www.digikey.com/product-detail/en/yageo/CC0805KRX7R8BB104/311-1141-1-ND/303051; ComponentKind: X7R; Value: 0.1 μF
C104 C105 C118 C122 C123 = Capacitor: as C32 on sheet Page 1; HelpURL: https://www.digikey.com/product-detail/en/yageo/CC0805KKX7R8BB105/311-1456-1-ND/2833762; ComponentKind: X7R; Value: 1 μF
C106 C124 = TantalCap: as C33 on sheet Page 1; HelpURL: https://www.digikey.com/product-detail/en/vishay-sprague/TR3C106K025C0300/718-1508-1-ND/1859983; ComponentKind: 25V; Value: 10 μF
C107-C109 = Capacitor: as C62 on sheet Page 1; HelpURL: https://www.digikey.com/product-detail/en/epcos-tdk/B32021A3472M000/495-4082-ND/2045205; Value: 4.7 nF
C111 C119 = Capacitor: as C56 on sheet Page 1; HelpURL: https://www.digikey.com/product-detail/en/yageo/CC0805KRX7R9BB102/311-1127-1-ND/303037; ComponentKind: X7R; Value: 1 nF
C112 C114 C126 C129 = Capacitor: as C1 on sheet Page 1; HelpURL: https://www.digikey.com/product-detail/en/yageo/CC0805KRX7R9BB471/311-1124-1-ND/303034; ComponentKind: X7R; Value: 470 pF
C116 C117 = Capacitor: Manufacturer: Epcos; Model: B32676E4106K000; HelpURL: https://www.digikey.com/products/en?keywords=B32676E4106K000; ComponentKind: 275V AC; Value: 10 μF
D23 D27-D29 D33 D34 = MCP6001T: as D2 on sheet Page 1; HelpURL: https://www.digikey.com/product-detail/en/microchip-technology/MCP6001T-I-OT/MCP6001T-I-OTCT-ND/697158; ComponentKind: SOT23-5
D24 D30 = UCC27714DR: Half-bridge driver; Manufacturer: Texas Instruments; Model: UCC27714DR; HelpURL: https://www.digikey.com/product-detail/en/texas-instruments/UCC27714DR/296-42701-1-ND/5455966; ComponentKind: 14-SOIC
D25 D31 = IR25750LTRPBF: as D6 on sheet Page 1; Model: IR25750LTRPBF; ComponentKind: SOT23-5; HelpURL: https://www.digikey.com/product-detail/en/infineon-technologies/IR25750LTRPBF/IR25750LTRPBFCT-ND/4743688
D26 = ACS770LCB: Sensor; Manufacturer: Allegro MicroSystems, LLC; Model: ACS758LCB-050B-PFF-T; HelpURL: https://www.digikey.com/product-detail/en/allegro-microsystems-llc/ACS758LCB-050B-PFF-T/620-1320-ND/2042745; ComponentKind: 40mV/A
D32 = ISO7340FCDWR: Isolator; Manufacturer: Texas Instruments; Model: ISO7340FCDWR; ComponentKind: 16-SOIC; HelpURL: https://www.digikey.com/product-detail/en/texas-instruments/ISO7340FCDWR/296-47262-1-ND/7688272
L4 = Inductor ring: as L1 on sheet Page 1; Value: 500 μH; ComponentKind: 60 μ; HelpURL: http://ferrite.ru/warehouse/r-46-724-118-77439-a7.html
L5 = EMI filter: Manufacturer: Magnetics; Model: 0077071A7; HelpURL: http://ferrite.ru/warehouse/r-32-820-110-7-77071-a7.html; ComponentKind: R32/20/10
R112 R114 R123 R130 R132 R140 = Resistor: as R15 on sheet Page 1; HelpURL: https://www.digikey.com/product-detail/en/yageo/RC0805JR-072R2L/311-2.2ARCT-ND/731217; ComponentKind: 0805; Value: 2R2
R113 R127 = Resistor: as R1 on sheet Page 1; HelpURL: https://www.digikey.com/product-detail/en/yageo/RC0805FR-07100KL/311-100KCRCT-ND/730491; Value: 100k
R115 R117 R118 R126 R133-R135 R143 = Resistor: as R24 on sheet Page 1; HelpURL: https://www.digikey.com/product-detail/en/yageo/RC0805JR-0710KL/311-10KARCT-ND/731188; ComponentKind: 0805; Value: 10k
R116 R119 R121 R129 R136 R138 = Resistor: as R4 on sheet Page 1; HelpURL: https://www.digikey.com/product-detail/en/yageo/RC0805JR-071KL/311-1.0KARCT-ND/731165; ComponentKind: 0805; Value: 1k
R120 R122 R125 R128 R131 R137 R139 R142 = Resistor: as R6 on sheet Page 1; HelpURL: https://www.digikey.com/product-detail/en/yageo/RC0805FR-0710KL/311-10.0KCRCT-ND/730482; Value: 10k
R124 R141 = Resistor: as R102 on sheet Page 2; HelpURL: https://www.digikey.com/product-detail/en/yageo/RC0805FR-072K7L/311-2.70KCRCT-ND/730653; Value: 2k7
T3 = Sensor: Manufacturer: НПК «Комплекс»; Model: ТПГ-0.7-3В; HelpURL: https://www.chipdip.ru/product/tpk-0.7-3v; ComponentKind: Voltage sensor
VD70 VD74 VD81 VD85 = Diod Zener: Manufacturer: Littelfuse Inc.; ComponentKind: SMC; Model: SMCJ400A; HelpURL: https://www.digikey.com/product-detail/en/littelfuse-inc/SMCJ400A/SMCJ400ALFCT-ND/762670
VD71 VD82 = Diod: Manufacturer: ON Semiconductor; ComponentKind: SMC; Model: MURS360T3G; HelpURL: https://www.digikey.com/product-detail/en/on-semiconductor/MURS360T3G/MURS360T3GOSCT-ND/964580
VD72 VD75 VD77-VD80 VD83 VD86 = Diod Schottky: Manufacturer: Fairchild/ON Semiconductor; ComponentKind: SOD-123F; Model: SS24FL; HelpURL: https://www.digikey.com/product-detail/en/fairchild-on-semiconductor/SS24FL/SS24FLCT-ND/5305093
VD73 VD76 VD84 VD87 = TVS-diod: as VD19 on sheet Page 1; ComponentKind: SOD-323; HelpURL: https://www.digikey.com/product-detail/en/littelfuse-inc/SD15C-01FTG/F6444CT-ND/5019598
VT20-VT23 = N-chanel: Mosfet; Manufacturer: Infineon Technologies; Model: IPP60R099P7XKSA1; ComponentKind: TO-220; HelpURL: https://www.digikey.com/products/en?keywords=IPP60R099P7XKSA1
X10 = 4-Connector: Manufacturer: Ningbo Xinya M&E; Model: X977B04; HelpURL: https://www.chipdip.ru/product/x977b04; ComponentKind: 10A

## Nets that join several sheets
GND: Page 1 (167 pins), Page 2 (51 pins), Page 3 (15 pins)
GND2: Page 1 (21 pins), Page 3 (43 pins)
VCC_3V3: Page 1 (17 pins), Page 2 (31 pins), Page 3 (6 pins)
VCC_5V: Page 1 (5 pins), Page 2 (C88.2 D21.8 X5.1 X6.1), Page 3 (C110.2 D26.1)
VCC_12V: Page 1 (19 pins), Page 2 (X8.1 X9.1)
VCCH_5V: Page 1 (C61.2 D13.2 D13.4 R60.2), Page 3 (12 pins)
VCCH_380V: Page 1 (6 pins), Page 3 (VD70.2 VD81.2 VT20.2 VT22.2)
ADC_CUR_IN: Page 1 (D3.1 R2.2), Page 2 (D18.15)
ADC_CUR_OUT: Page 2 (D18.17), Page 3 (D23.1 R113.1)
ADC_VCC_IN: Page 1 (D2.1 R1.2), Page 2 (D18.14)
ADC_VCC_OUT: Page 2 (D18.16), Page 3 (D29.1 R127.2)
CH1_ENABLE: Page 1 (R13.2), Page 2 (D18.28)
CH2_ENABLE: Page 1 (R39.2), Page 2 (D18.29)
PWM1_CH1: Page 2 (D18.41), Page 3 (D32.3)
PWM1_CH2: Page 2 (D18.42), Page 3 (D32.4)
PWM1_CH3: Page 2 (D18.43), Page 3 (D32.5)
PWM1_CH4: Page 2 (D18.44), Page 3 (D32.6)
PWM3_CH3: Page 1 (R23.2), Page 2 (D18.26)
PWM3_CH4: Page 1 (R49.2), Page 2 (D18.27)